# EAGLE design stm v0.1 (EAGLE 9.4.1)
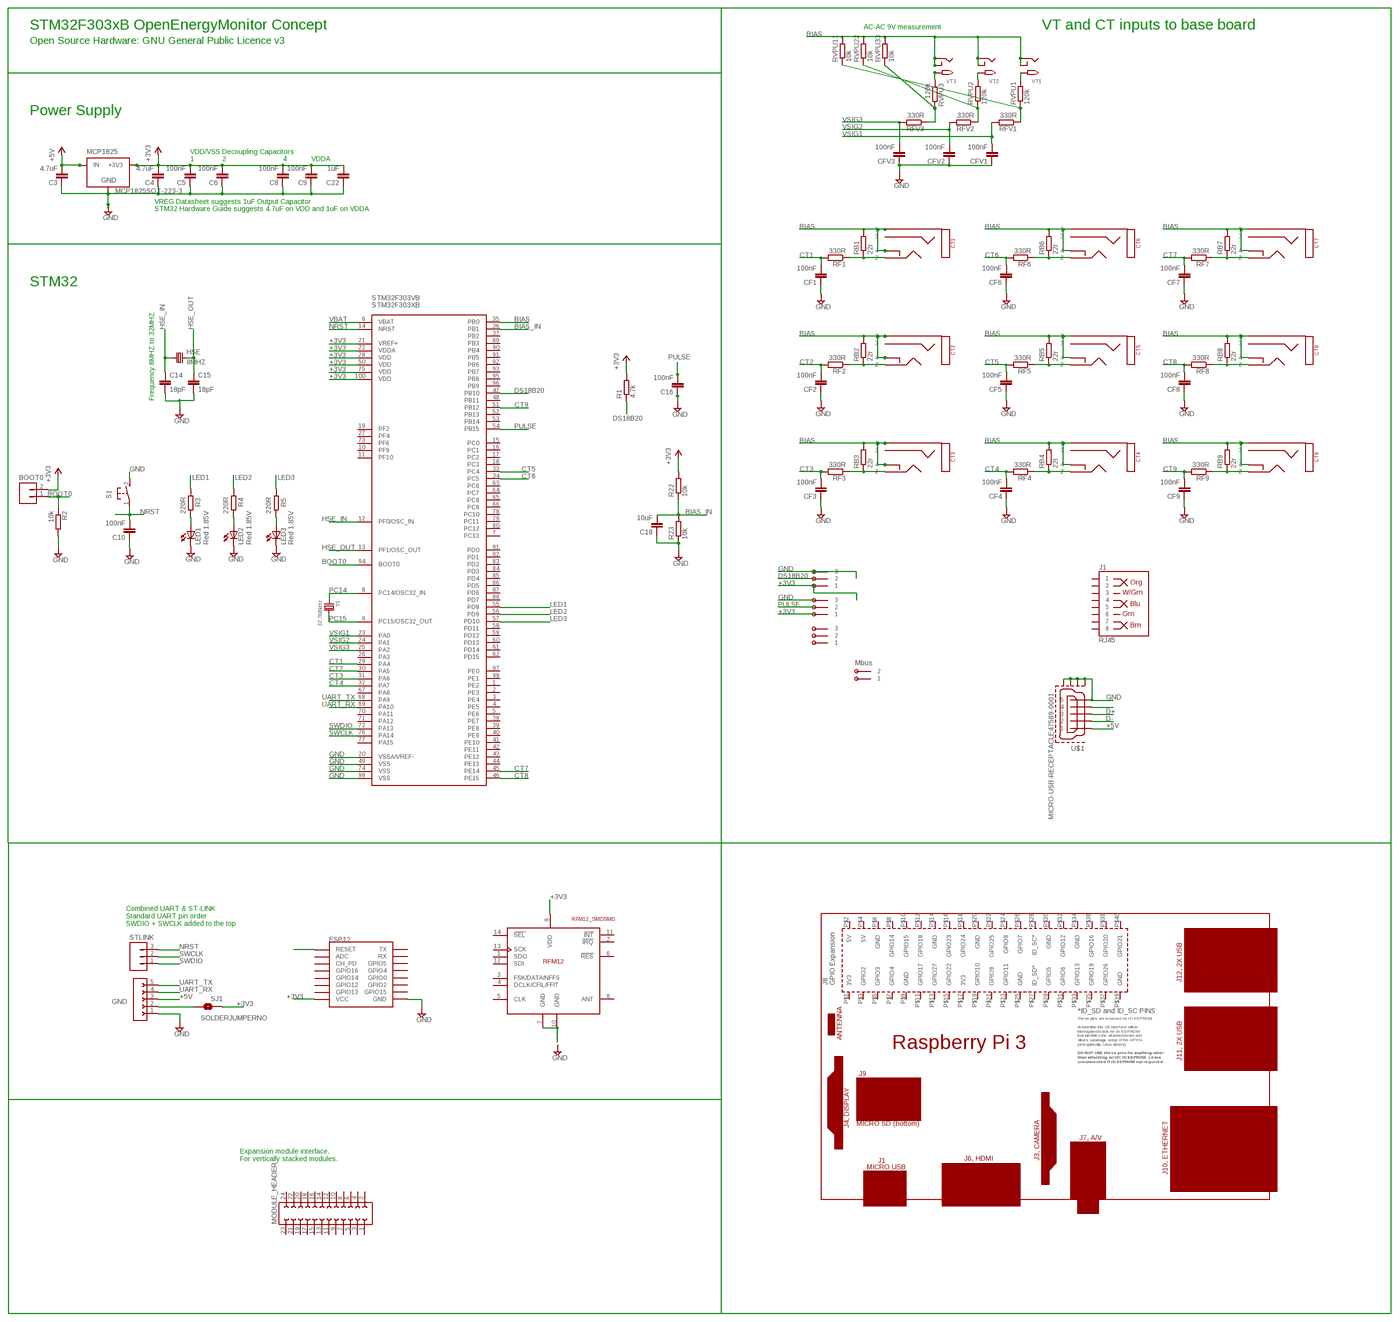
[diagram p0: schematic, sheet 1, overview]
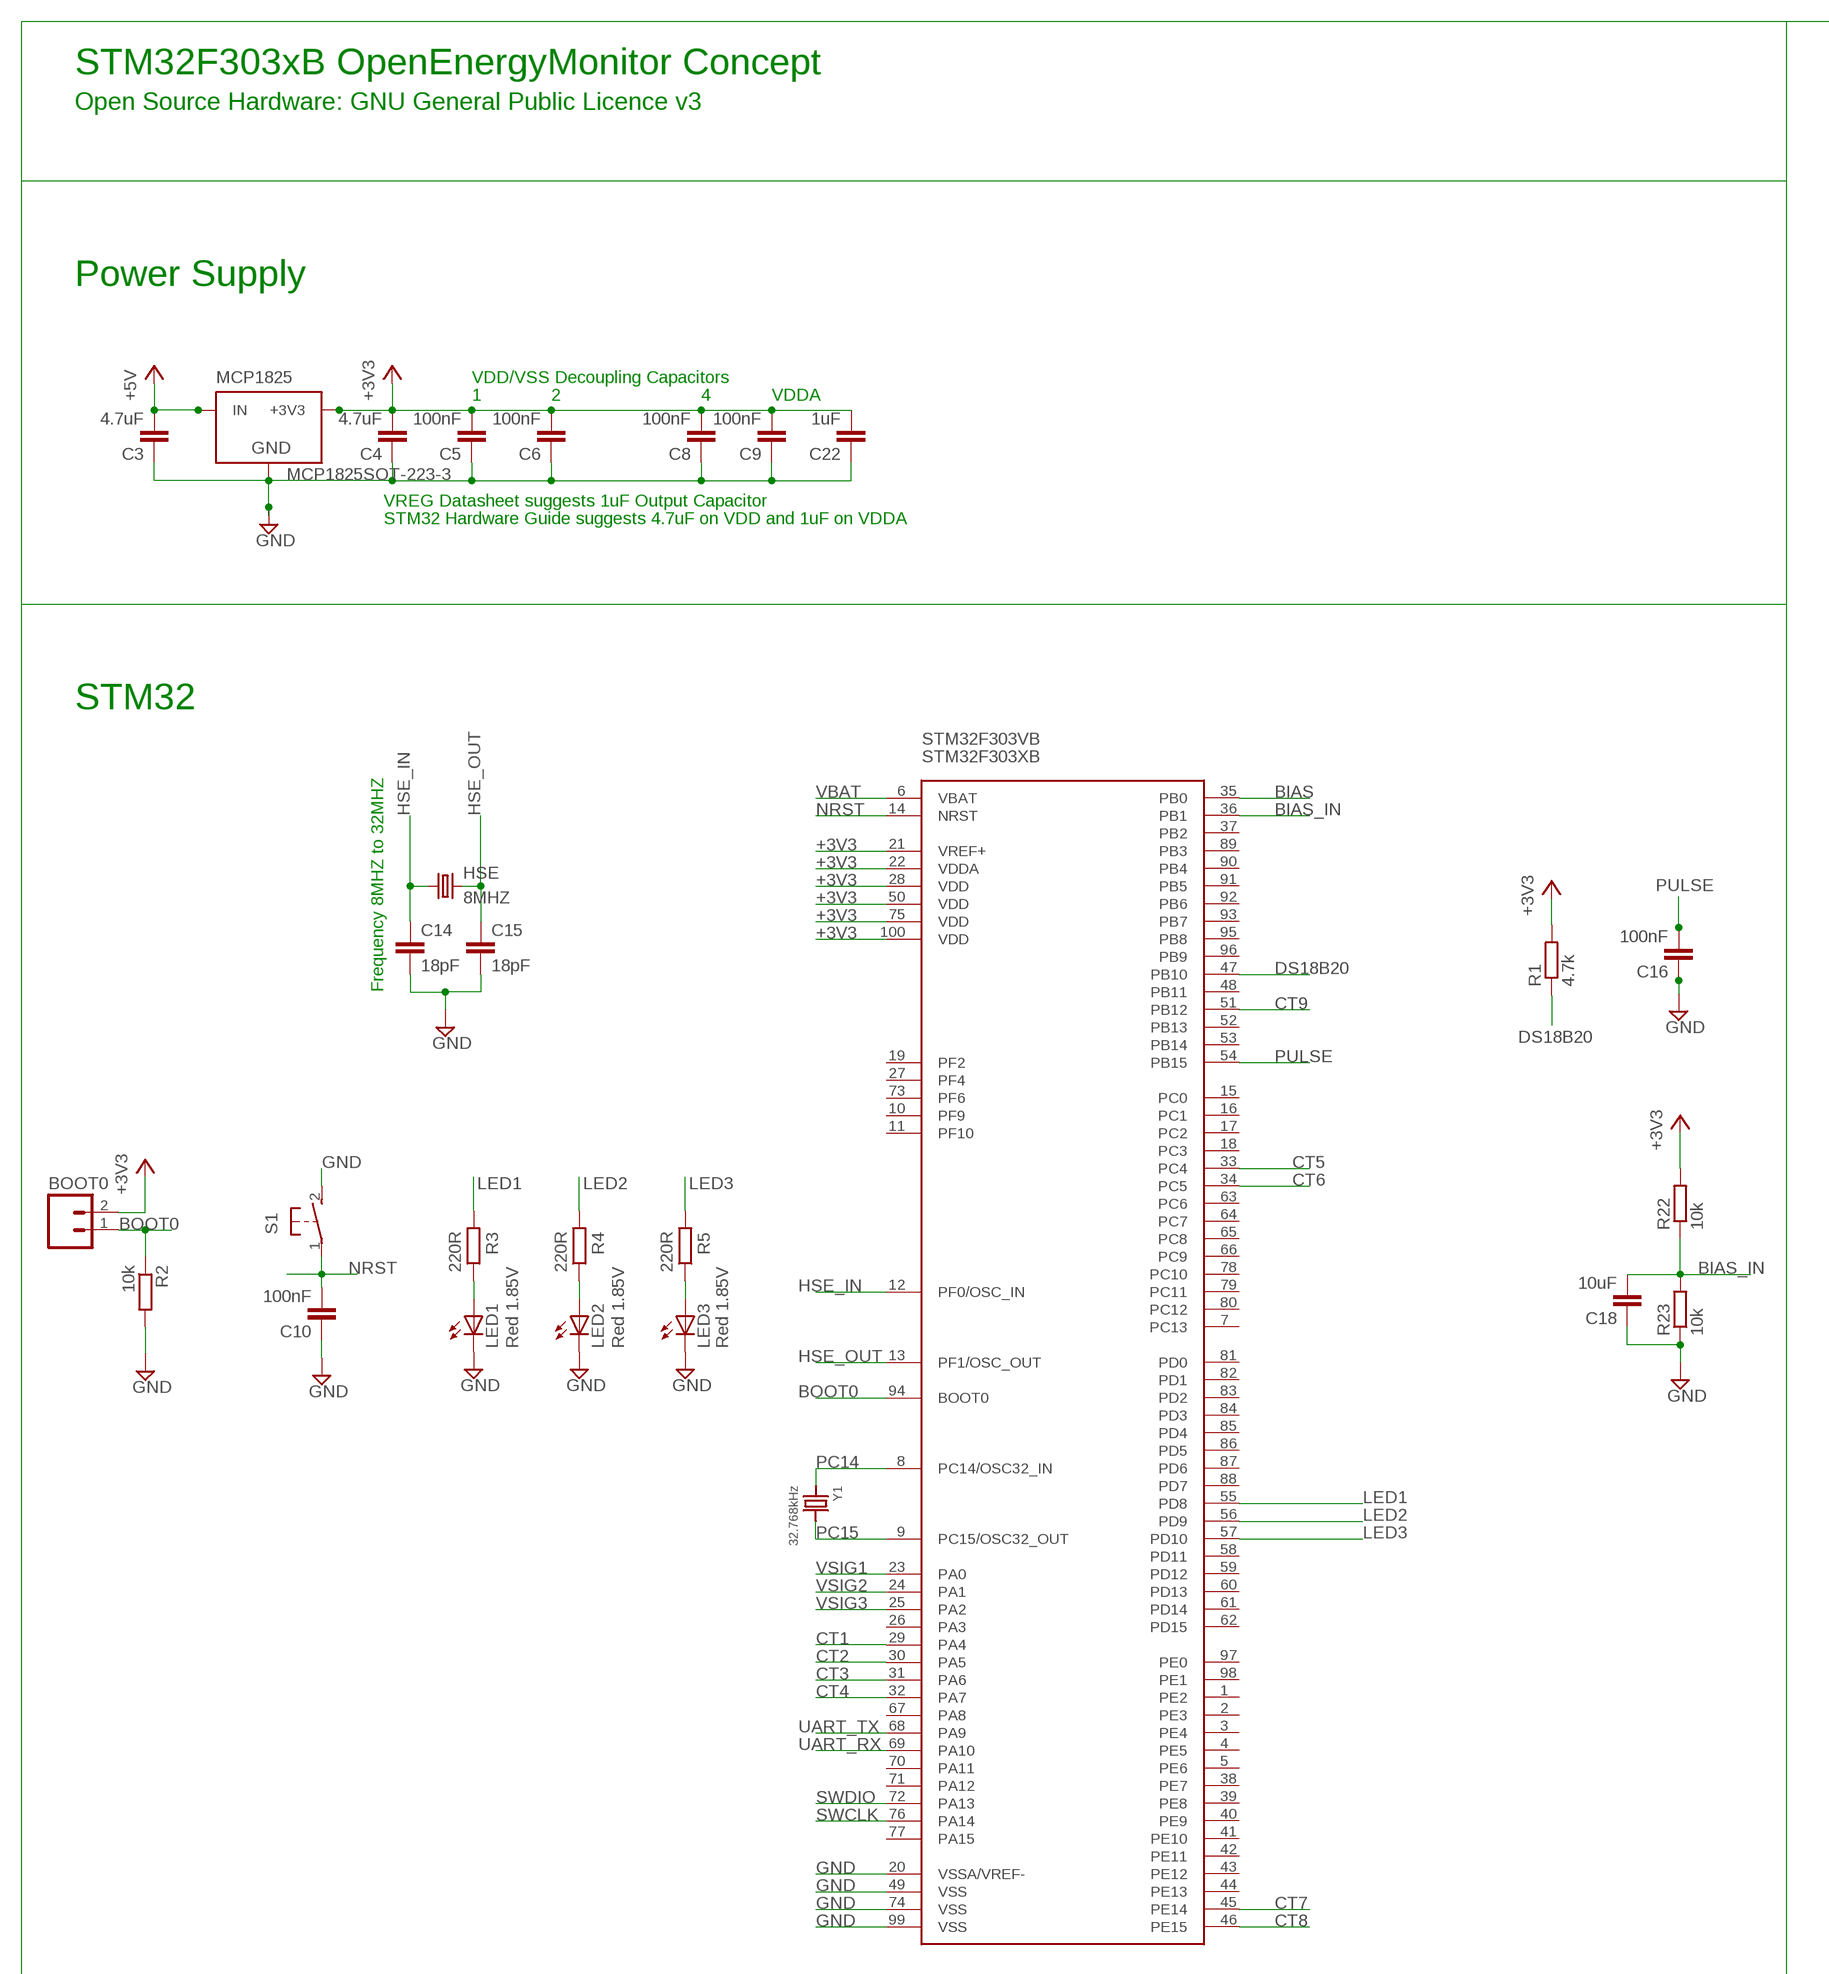
[diagram p1: schematic, sheet 1, part 1 of 4]
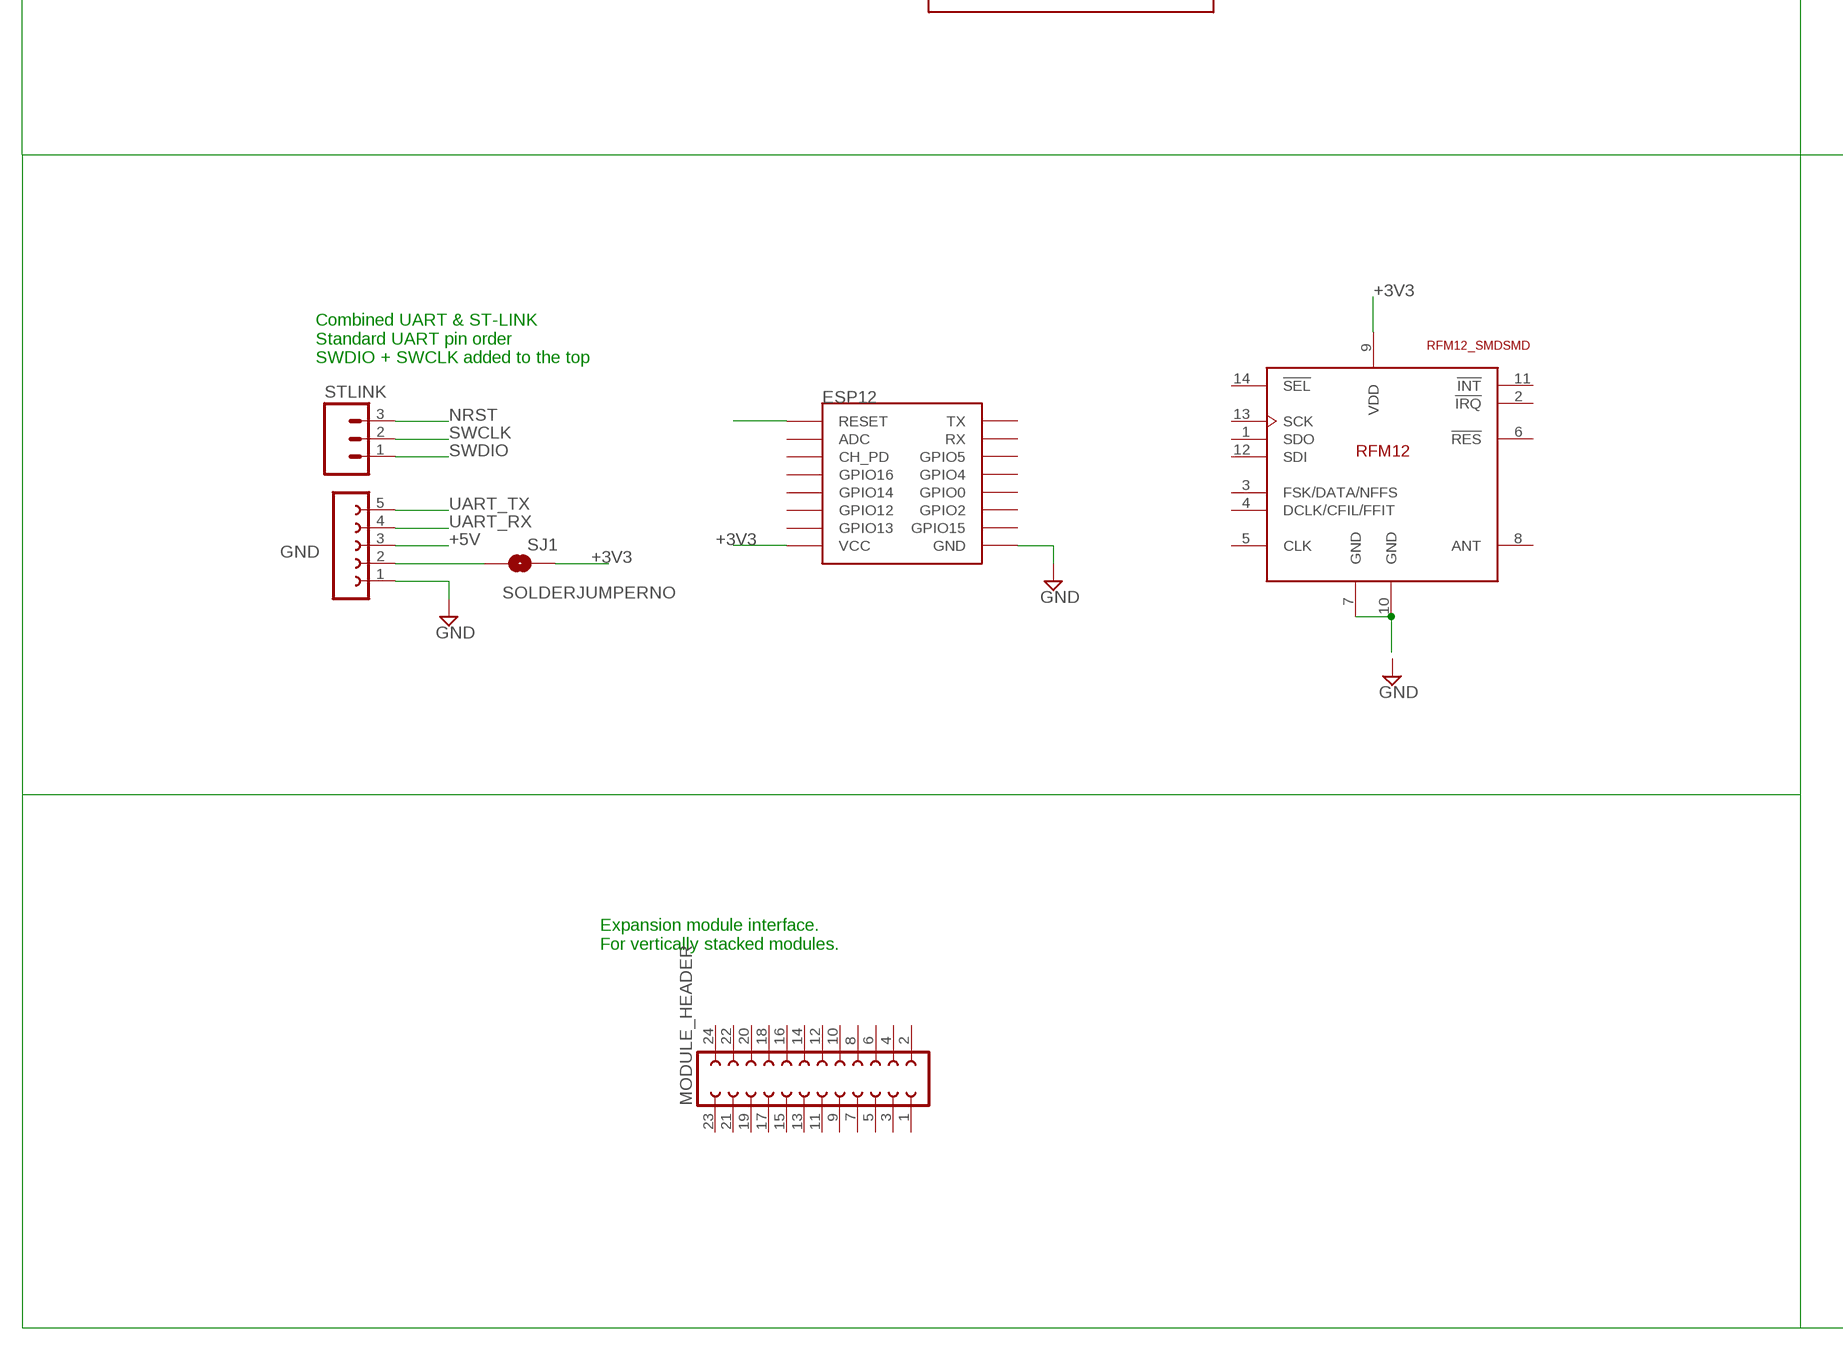
[diagram p2: schematic, sheet 1, part 2 of 4]
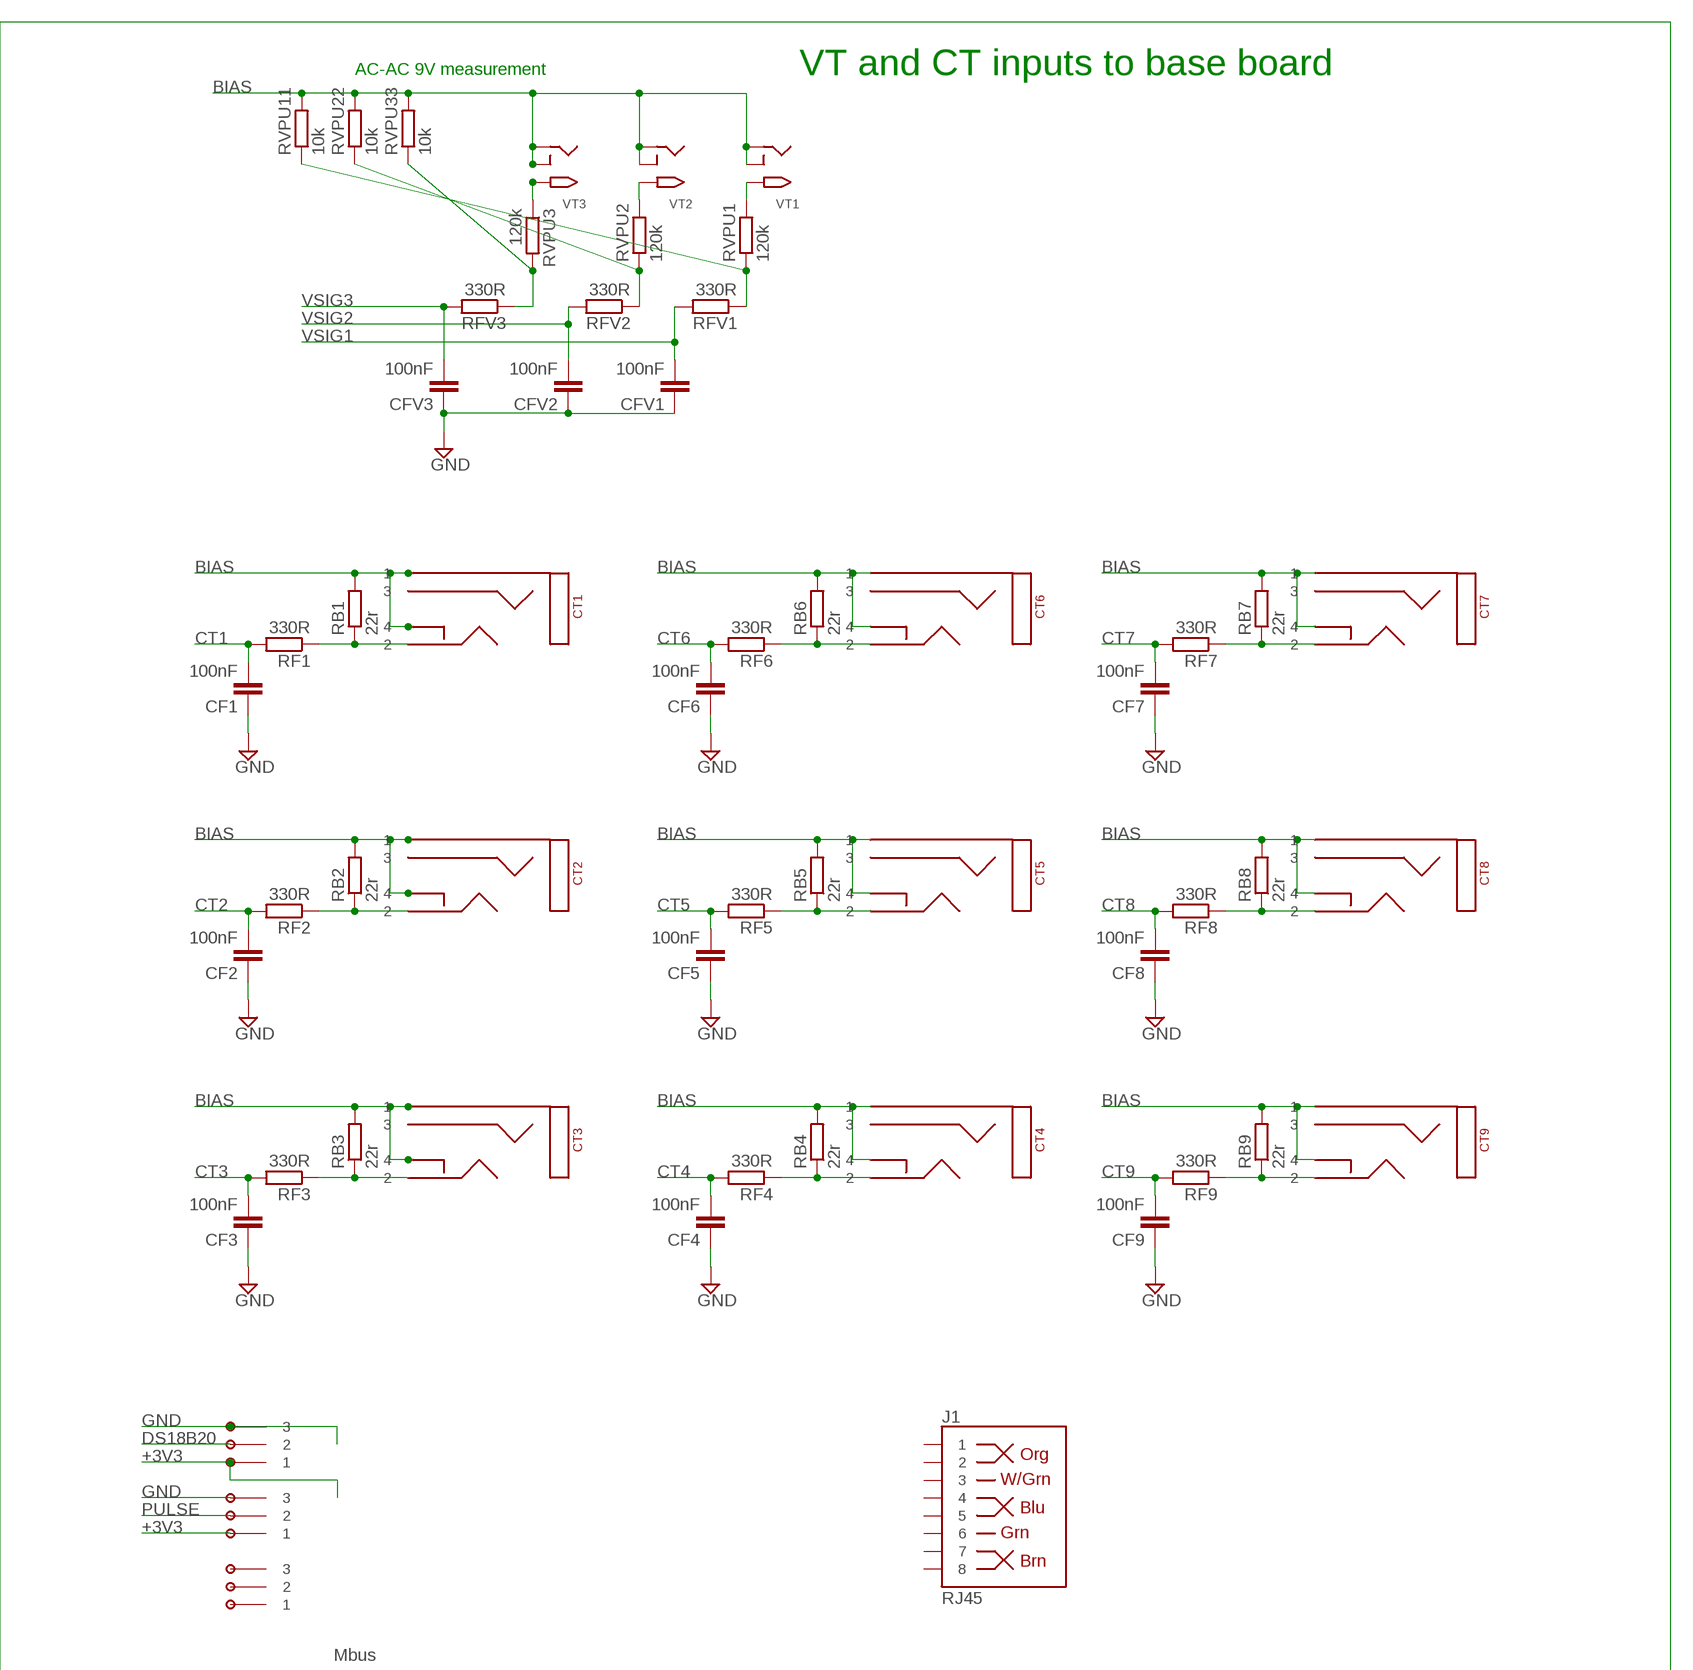
[diagram p3: schematic, sheet 1, part 3 of 4]
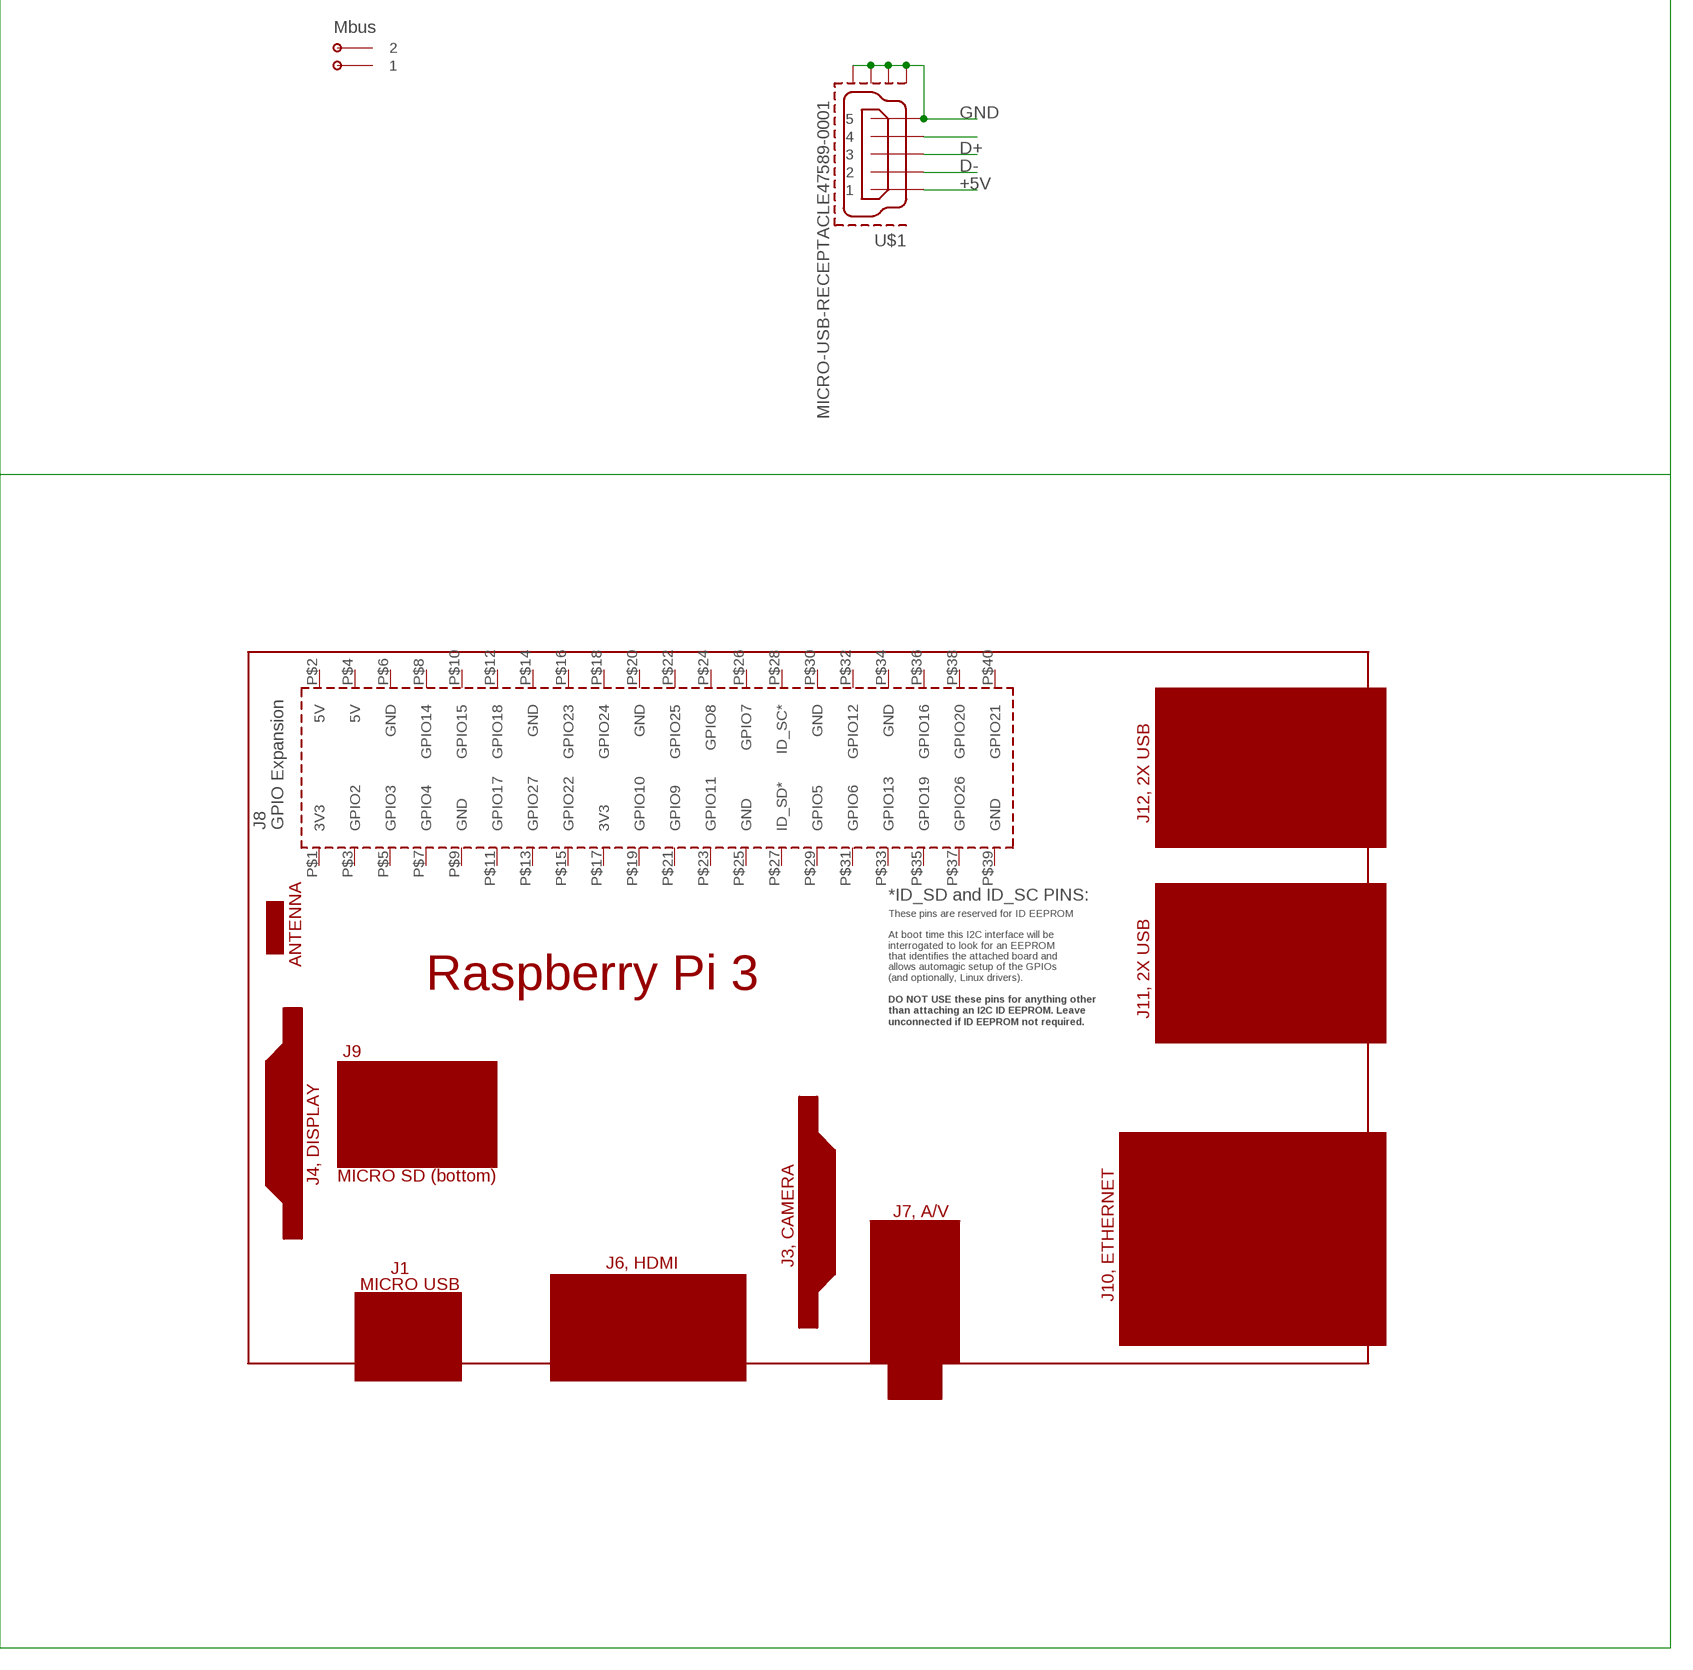
[diagram p4: schematic, sheet 1, part 4 of 4]

## Parts
BOOT0  M02PTH  [1X02]
C3  4.7uF  C-EUC1210  [C1210]
C4  4.7uF  C-EUC1210  [C1210]
C5  100nF  C-EUC0603  [C0603]
C6  100nF  C-EUC0603  [C0603]
C8  100nF  C-EUC0603  [C0603]
C9  100nF  C-EUC0603  [C0603]
C10  100nF  C-EUC0603  [C0603]
C14  18pF  C-EUC0603  [C0603]
C15  18pF  C-EUC0603  [C0603]
C16  100nF  C-EUC0603  [C0603]
C18  10uF  C-EUC0603  [C0603]
C22  1uF  C-EUC1210  [C1210]
CF1  100nF  C-EUC0603  [C0603]
CF2  100nF  C-EUC0603  [C0603]
CF3  100nF  C-EUC0603  [C0603]
CF4  100nF  C-EUC0603  [C0603]
CF5  100nF  C-EUC0603  [C0603]
CF6  100nF  C-EUC0603  [C0603]
CF7  100nF  C-EUC0603  [C0603]
CF8  100nF  C-EUC0603  [C0603]
CF9  100nF  C-EUC0603  [C0603]
CFV1  100nF  C-EUC0603  [C0603]
CFV2  100nF  C-EUC0603  [C0603]
CFV3  100nF  C-EUC0603  [C0603]
CT1  STEREO_SMD  [STEREO_SMT]
CT2  STEREO_SMD  [STEREO_SMT]
CT3  STEREO_SMD  [STEREO_SMT]
CT4  STEREO_SMD  [STEREO_SMT]
CT5  STEREO_SMD  [STEREO_SMT]
CT6  STEREO_SMD  [STEREO_SMT]
CT7  STEREO_SMD  [STEREO_SMT]
CT8  STEREO_SMD  [STEREO_SMT]
CT9  STEREO_SMD  [STEREO_SMT]
ESP12  ESP12SMD  [ESP12-SMD]
GND  UART  FE05-1  [FE05-1]
HSE  8MHZ  CRYSTALCTS406  [CTS406]
J1  RJ45  RJ45-8  [RJ45-8]
LED1  Red 1.85V  LEDCHIP-LED0805  [CHIP-LED0805]
LED2  Red 1.85V  LEDCHIP-LED0805  [CHIP-LED0805]
LED3  Red 1.85V  LEDCHIP-LED0805  [CHIP-LED0805]
MCP1825  MCP1825SOT-223-3  [SOT-223]
MODULE_HEADER  FE12-2  [FE12-2]
PCB1  RPI3RPI3  [RPI3]
R1  4.7k  R-EU_R0603  [R0603]
R2  10k  R-EU_R0603  [R0603]
R3  220R  R-EU_R0603  [R0603]
R4  220R  R-EU_R0603  [R0603]
R5  220R  R-EU_R0603  [R0603]
R22  10k  R-EU_R0603  [R0603]
R23  10k  R-EU_R0603  [R0603]
RB1  22r  R-EU_R0603  [R0603]
RB2  22r  R-EU_R0603  [R0603]
RB3  22r  R-EU_R0603  [R0603]
RB4  22r  R-EU_R0603  [R0603]
RB5  22r  R-EU_R0603  [R0603]
RB6  22r  R-EU_R0603  [R0603]
RB7  22r  R-EU_R0603  [R0603]
RB8  22r  R-EU_R0603  [R0603]
RB9  22r  R-EU_R0603  [R0603]
RF1  330R  R-EU_R0603  [R0603]
RF2  330R  R-EU_R0603  [R0603]
RF3  330R  R-EU_R0603  [R0603]
RF4  330R  R-EU_R0603  [R0603]
RF5  330R  R-EU_R0603  [R0603]
RF6  330R  R-EU_R0603  [R0603]
RF7  330R  R-EU_R0603  [R0603]
RF8  330R  R-EU_R0603  [R0603]
RF9  330R  R-EU_R0603  [R0603]
RFM69HCW  RFM12_SMDSMD  [RFM12]
RFV1  330R  R-EU_R0603  [R0603]
RFV2  330R  R-EU_R0603  [R0603]
RFV3  330R  R-EU_R0603  [R0603]
RVPU1  120k  R-EU_R0603  [R0603]
RVPU2  120k  R-EU_R0603  [R0603]
RVPU3  120k  R-EU_R0603  [R0603]
RVPU11  10k  R-EU_R0603  [R0603]
RVPU22  10k  R-EU_R0603  [R0603]
RVPU33  10k  R-EU_R0603  [R0603]
S1  31-XX  [B3F-31XX]
SJ1  SOLDERJUMPERNO  [SJ_2S-NO]
STLINK  M03PTH  [1X03]
STM32F303VB  STM32F303XB  [TQFP100]
U$1  MICRO-USB-RECEPTACLE47589-0001  [47589-0001]
U$4  OMNIMATE_LSF_3  [OMNIMATE_LSF_3]
U$5  OMNIMATE_LSF_3  [OMNIMATE_LSF_3]
U$6  OMNIMATE_LSF_3  [OMNIMATE_LSF_3]
U$11  OMNIMATE_LSF_2  [OMNIMATE_LSF_2]
VT1  2.1MMJACKSMT  [DCJACK_2MM_SMT]
VT2  2.1MMJACKSMT  [DCJACK_2MM_SMT]
VT3  2.1MMJACKSMT  [DCJACK_2MM_SMT]
Y1  32.768kHz  CRYSTAL8X3.8SMT  [CRYSTAL_8X3.8]

## Nets
+3V3: BOOT0.2 C4.2 C5.2 C6.2 C8.2 C9.2 C22.2 ESP12.VCC MCP1825.3(+3V3) R1.2 R22.2 RFM69HCW.9(VDD) SJ1.2 STM32F303VB.21(VREF+) STM32F303VB.22(VDDA) STM32F303VB.28(VDD) STM32F303VB.50(VDD) STM32F303VB.75(VDD) STM32F303VB.100(VDD) U$4.P$1 U$4.P$2 U$5.P$1 U$5.P$2
+5V [power]: C3.2 GND.3 MCP1825.1(IN) U$1.1
AC1: RVPU1.2 VT1.PWR2(TIP)
AC2: RVPU2.2 VT2.PWR2(TIP)
AC3: RVPU3.1 VT3.PWR2(TIP)
ADC0: RFV3.1 RVPU3.2 RVPU33.1
BIAS: CT1.P$1 CT1.P$4 CT2.P$1 CT2.P$4 CT3.P$1 CT3.P$4 CT4.P$1 CT4.P$4 CT5.P$1 CT5.P$4 CT6.P$1 CT6.P$4 CT7.P$1 CT7.P$4 CT8.P$1 CT8.P$4 CT9.P$1 CT9.P$4 RB1.2 RB2.2 RB3.2 RB4.2 RB5.2 RB6.2 RB7.2 RB8.2 RB9.2 RVPU11.2 RVPU22.2 RVPU33.2 STM32F303VB.35(PB0) VT1.GND(RING) VT1.GNDBREAK(RING_SW) VT2.GND(RING) VT2.GNDBREAK(RING_SW) VT3.GND(RING) VT3.GNDBREAK(RING_SW)
BIAS_IN: C18.2 R22.1 R23.2 STM32F303VB.36(PB1)
BOOT0: BOOT0.1 R2.1 STM32F303VB.94(BOOT0)
CT1: CF1.2 RF1.2 STM32F303VB.29(PA4)
CT2: CF2.2 RF2.2 STM32F303VB.30(PA5)
CT3: CF3.2 RF3.2 STM32F303VB.31(PA6)
CT4: CF4.2 RF4.2 STM32F303VB.32(PA7)
CT5: CF5.2 RF5.2 STM32F303VB.33(PC4)
CT6: CF6.2 RF6.2 STM32F303VB.34(PC5)
CT7: CF7.2 RF7.2 STM32F303VB.45(PE14)
CT8: CF8.2 RF8.2 STM32F303VB.46(PE15)
CT9: CF9.2 RF9.2 STM32F303VB.51(PB12)
D+: U$1.3
D-: U$1.2
DS18B20: R1.1 STM32F303VB.47(PB10) U$4.P$3 U$4.P$4
GND: C3.1 C4.1 C5.1 C6.1 C8.1 C9.1 C10.1 C14.2 C15.2 C16.1 C18.1 C22.1 CF1.1 CF2.1 CF3.1 CF4.1 CF5.1 CF6.1 CF7.1 CF8.1 CF9.1 CFV1.1 CFV2.1 CFV3.1 ESP12.GND GND.1 LED1.C LED2.C LED3.C MCP1825.2(GND) R2.2 R23.1 S1.2(S) STM32F303VB.20(VSSA/VREF-) STM32F303VB.49(VSS) STM32F303VB.74(VSS) STM32F303VB.99(VSS) U$1.5 U$1.CASING1(GND1) U$1.CASING2(GND2) U$1.CASING3(GND3) U$1.CASING4(GND4) U$4.P$5 U$4.P$6 U$5.P$5 U$5.P$6
HSE_IN: C14.1 HSE.1 STM32F303VB.12(PF0/OSC_IN)
HSE_OUT: C15.1 HSE.3 STM32F303VB.13(PF1/OSC_OUT)
LED1: R3.2 STM32F303VB.55(PD8)
LED2: R4.2 STM32F303VB.56(PD9)
LED3: R5.2 STM32F303VB.57(PD10)
N$1: GND.2 SJ1.1
N$2: CT1.P$2 RB1.1 RF1.1
N$5: LED2.A R4.1
N$6: LED3.A R5.1
N$7: ESP12.RESET
N$8: CT2.P$2 RB2.1 RF2.1
N$9: RFM69HCW.7(GND) RFM69HCW.10(GND)
N$10: CT3.P$2 RB3.1 RF3.1
N$12: U$1.4
N$34: RFV2.1 RVPU2.1 RVPU22.1
N$37: RFV1.1 RVPU1.1 RVPU11.1
N$38: CT4.P$2 RB4.1 RF4.1
N$39: CT5.P$2 RB5.1 RF5.1
N$40: CT6.P$2 RB6.1 RF6.1
N$41: LED1.A R3.1
N$42: CT7.P$2 RB7.1 RF7.1
N$43: CT8.P$2 RB8.1 RF8.1
N$44: CT9.P$2 RB9.1 RF9.1
NRST: C10.2 S1.1(P) STLINK.3 STM32F303VB.14(NRST)
PC14: STM32F303VB.8(PC14/OSC32_IN) Y1.P$1
PC15: STM32F303VB.9(PC15/OSC32_OUT) Y1.P$4
PULSE: C16.2 STM32F303VB.54(PB15) U$5.P$3 U$5.P$4
SWCLK: STLINK.2 STM32F303VB.76(PA14)
SWDIO: STLINK.1 STM32F303VB.72(PA13)
UART_RX: GND.4 STM32F303VB.69(PA10)
UART_TX: GND.5 STM32F303VB.68(PA9)
VBAT: STM32F303VB.6(VBAT)
VSIG1: CFV1.2 RFV1.2 STM32F303VB.23(PA0)
VSIG2: CFV2.2 RFV2.2 STM32F303VB.24(PA1)
VSIG3: CFV3.2 RFV3.2 STM32F303VB.25(PA2)
Unconnected: CT1.P$3 CT2.P$3 CT3.P$3 CT4.P$3 CT5.P$3 CT6.P$3 CT7.P$3 CT8.P$3 CT9.P$3 ESP12.ADC ESP12.CH_PD ESP12.GPIO0 ESP12.GPIO2 ESP12.GPIO4 ESP12.GPIO5 ESP12.GPIO12 ESP12.GPIO13 ESP12.GPIO14 ESP12.GPIO15 ESP12.GPIO16 ESP12.RXD0(RX) ESP12.TXD0(TX) J1.1 J1.2 J1.3 J1.4 J1.5 J1.6 J1.7 J1.8 MODULE_HEADER.1 MODULE_HEADER.2 MODULE_HEADER.3 MODULE_HEADER.4 MODULE_HEADER.5 MODULE_HEADER.6 MODULE_HEADER.7 MODULE_HEADER.8 MODULE_HEADER.9 MODULE_HEADER.10 MODULE_HEADER.11 MODULE_HEADER.12 MODULE_HEADER.13 MODULE_HEADER.14 MODULE_HEADER.15 MODULE_HEADER.16 MODULE_HEADER.17 MODULE_HEADER.18 MODULE_HEADER.19 MODULE_HEADER.20 MODULE_HEADER.21 MODULE_HEADER.22 MODULE_HEADER.23 MODULE_HEADER.24 PCB1.P$1(3V3) PCB1.P$2(5V) PCB1.P$3(GPIO2) PCB1.P$4(5V) PCB1.P$5(GPIO3) PCB1.P$6(GND) PCB1.P$7(GPIO4) PCB1.P$8(GPIO14) PCB1.P$9(GND) PCB1.P$10(GPIO15) PCB1.P$11(GPIO17) PCB1.P$12(GPIO18) PCB1.P$13(GPIO27) PCB1.P$14(GND) PCB1.P$15(GPIO22) PCB1.P$16(GPIO23) PCB1.P$17(3V3) PCB1.P$18(GPIO24) PCB1.P$19(GPIO10) PCB1.P$20(GND) PCB1.P$21(GPIO9) PCB1.P$22(GPIO25) PCB1.P$23(GPIO11) PCB1.P$24(GPIO8) PCB1.P$25(GND) PCB1.P$26(GPIO7) PCB1.P$27(ID_SD*) PCB1.P$28(ID_SC*) PCB1.P$29(GPIO5) PCB1.P$30(GND) PCB1.P$31(GPIO6) PCB1.P$32(GPIO12) PCB1.P$33(GPIO13) PCB1.P$34(GND) PCB1.P$35(GPIO19) PCB1.P$36(GPIO16) PCB1.P$37(GPIO26) PCB1.P$38(GPIO20) PCB1.P$39(GND) PCB1.P$40(GPIO21) RFM69HCW.1(SDO) RFM69HCW.2(!IRQ) RFM69HCW.3(FSK/DATA/NFFS) RFM69HCW.4(DCLK/CFIL/FFIT) RFM69HCW.5(CLK) RFM69HCW.6(!RES) RFM69HCW.8(ANT) RFM69HCW.11(!INT) RFM69HCW.12(SDI) RFM69HCW.13(SCK) RFM69HCW.14(!SEL) STM32F303VB.1(PE2) STM32F303VB.2(PE3) STM32F303VB.3(PE4) STM32F303VB.4(PE5) STM32F303VB.5(PE6) STM32F303VB.7(PC13) STM32F303VB.10(PF9) STM32F303VB.11(PF10) STM32F303VB.15(PC0) STM32F303VB.16(PC1) STM32F303VB.17(PC2) STM32F303VB.18(PC3) STM32F303VB.19(PF2) STM32F303VB.26(PA3) STM32F303VB.27(PF4) STM32F303VB.37(PB2) STM32F303VB.38(PE7) STM32F303VB.39(PE8) STM32F303VB.40(PE9) STM32F303VB.41(PE10) STM32F303VB.42(PE11) STM32F303VB.43(PE12) STM32F303VB.44(PE13) STM32F303VB.48(PB11) STM32F303VB.52(PB13) STM32F303VB.53(PB14) STM32F303VB.58(PD11) STM32F303VB.59(PD12) STM32F303VB.60(PD13) STM32F303VB.61(PD14) STM32F303VB.62(PD15) STM32F303VB.63(PC6) STM32F303VB.64(PC7) STM32F303VB.65(PC8) STM32F303VB.66(PC9) STM32F303VB.67(PA8) STM32F303VB.70(PA11) STM32F303VB.71(PA12) STM32F303VB.73(PF6) STM32F303VB.77(PA15) STM32F303VB.78(PC10) STM32F303VB.79(PC11) STM32F303VB.80(PC12) STM32F303VB.81(PD0) STM32F303VB.82(PD1) STM32F303VB.83(PD2) STM32F303VB.84(PD3) STM32F303VB.85(PD4) STM32F303VB.86(PD5) STM32F303VB.87(PD6) STM32F303VB.88(PD7) STM32F303VB.89(PB3) STM32F303VB.90(PB4) STM32F303VB.91(PB5) STM32F303VB.92(PB6) STM32F303VB.93(PB7) STM32F303VB.95(PB8) STM32F303VB.96(PB9) STM32F303VB.97(PE0) STM32F303VB.98(PE1) U$6.P$1 U$6.P$2 U$6.P$3 U$6.P$4 U$6.P$5 U$6.P$6 U$11.P$1 U$11.P$2 U$11.P$3 U$11.P$4

## Notes on the sheet
- STM32F303xB OpenEnergyMonitor Concept | AC-AC 9V measurement | VT and CT inputs to base board
- Open Source Hardware: GNU General Public Licence v3
- Power Supply
- VDD/VSS Decoupling Capacitors
- 1 | 2 | 4 | VDDA
- VREG Datasheet suggests 1uF Output Capacitor
- STM32 Hardware Guide suggests 4.7uF on VDD and 1uF on VDDA
- STM32
- Frequency 8MHZ to 32MHZ
- Mbus
- Combined UART & ST-LINK
  Standard UART pin order
  SWDIO + SWCLK added to the top
- Expansion module interface.
  For vertically stacked modules.

## Library data of the parts
BOOT0 = SparkFun:M02: Header 2 Standard 2-pin 0.1" header. Use with straight break away headers (SKU : PRT-00116), right angle break away headers (PRT-00553), swiss pins (PRT-00743), machine pins (PRT-00117), and female headers (PRT-00115). Molex polarized connector foot print use with SKU : PRT-08233 with associated crimp pins and housings.
C3 C4 C22 = rcl:C-EU: CAPACITOR, European symbol; SPICEPREFIX: C
C5 C6 C8-C10 C14-C16 C18 CF1-CF9 CFV1-CFV3 = resistor:C-EU: CAPACITOR, European symbol
CT1-CT9 = IotaWatt_parts:STEREO_SMD: 3.5mm Stereo Jack SMT
ESP12 = ESP8266 MODULES _ CORRECTED:ESP12: ESP8266 Wifi module 12
GND = con-lsta:FE05-1: FEMALE HEADER; OC_FARNELL: unknown; OC_NEWARK: unknown
HSE = crystal:CRYSTAL: CRYSTAL; OC_FARNELL: unknown; OC_NEWARK: unknown
J1 = SparkFun-Connectors:RJ45-8: RJ45 Jack - 8 pin Simple RJ45, 8-pin connection. Commonly used for Cat5, Cat5e, and Cat6 Ethernet cables. Here is the connector we sell at SparkFun: RJ45 8-Pin Connector <https://www.sparkfun.com/products/643> (PRT-00643) Datasheet <https://cdn.sparkfun.com/datasheets/Prototyping/04908.pdf> It is used on this SparkFun product: SparkFun RJ45 Breakout <https://www.sparkfun.com/products/716> (BOB-00716) Note, you may also be interested in the "MAGJACK" version of this. It is basically a RJ45 connector, but also has some status LEDs built into the connector housing. You can check that out in this library at the device named "MAGJACK.dev" and see these products online: RJ45 Ethernet MagJack-Compatible <https://www.sparkfun.com/products/8534> (PRT-08534) SparkFun RJ45 MagJack Breakout <https://www.sparkfun.com/products/13021> (BOB-13021); PROD_ID: CONN-08506; SF_ID: PRT-00643
LED1-LED3 = adafruit:LED: LED OSRAM: - CHIPLED LG R971, LG N971, LY N971, LG Q971, LY Q971, LO R971, LY R971 LH N974, LH R974 LS Q976, LO Q976, LY Q976 LO Q996 - Hyper CHIPLED LW Q18S LB Q993, LB Q99A, LB R99A - SideLED LS A670, LO A670, LY A670, LG A670, LP A670 LB A673, LV A673, LT A673, LW A673 LH A674 LY A675 LS A676, LA A676, LO A676, LY A676, LW A676 LS A679, LY A679, LG A679 - Hyper Micro SIDELED® LS Y876, LA Y876, LO Y876, LY Y876 LT Y87S - SmartLED LW L88C, LW L88S LB L89C, LB L89S, LG L890 LS L89K, LO L89K, LY L89K LS L896, LA L896, LO L896, LY L896 - TOPLED LS T670, LO T670, LY T670, LG T670, LP T670 LSG T670, LSP T670, LSY T670, LOP T670, LYG T670 LG T671, LOG T671, LSG T671 LB T673, LV T673, LT T673, LW T673 LH T674 LS T676, LA T676, LO T676, LY T676, LB T676, LH T676, LSB T676, LW T676 LB T67C, LV T67C, LT T67C, LS T67K, LO T67K, LY T67K, LW E67C LS E67B, LA E67B, LO E67B, LY E67B, LB E67C, LV E67C, LT E67C LW T67C LS T679, LY T679, LG T679 LS T770, LO T770, LY T770, LG T770, LP T770 LB T773, LV T773, LT T773, LW T773 LH T774 LS E675, LA E675, LY E675, LS T675 LS T776, LA T776, LO T776, LY T776, LB T776 LHGB T686 LT T68C, LB T68C - Hyper Mini TOPLED® LB M676 - Mini TOPLED Santana® LG M470 LS M47K, LO M47K, LY M47K Source: http://www.osram.convergy.de/
MCP1825 = SteelCaveRobotics-Power:MCP1825: MCP1825 3.3v LDO Linear Regulator
MODULE_HEADER = con-lsta-RFM69Pi:FE12-2: FEMALE HEADER; OC_FARNELL: unknown; OC_NEWARK: unknown
PCB1 = e14_Rpi3_RevA+mirror-pcb copy:RPI3: Device for Raspberry Pi 3 board created by Dave Young for www.element14.com More information and support community is available at https://www.element14.com/community/community/raspberry-pi Device for Raspberry Pi 3 board updated by Gerald Schwarz for www.element14.com On RPI3 addet the layer milling and created a mirrored shield.
R1 R2 R22 R23 RB1-RB9 RF1-RF9 RFV1-RFV3 RVPU1-RVPU3 RVPU11 RVPU22 RVPU33 = resistor:R-EU_: RESISTOR, European symbol
R3-R5 = rcl:R-EU_: RESISTOR, European symbol; SPICEPREFIX: R
RFM69HCW = rfm12b _ rfm69cw:RFM12_SMD: RFM12 is a low costing ISM band transceiver module implemented with unique PLL. It works signal ranges from 315/433/868/915MHZ bands, comply with FCC, ETSI regulation. The SPI interface is used to communicate with microcontroller for parameter setting.
S1 = switch-omron:31-XX: OMRON SWITCH; MPN: B3F-3100; OC_FARNELL: 959704; OC_NEWARK: 36M3582
SJ1 = SparkFun:SOLDERJUMPER: Solder Jumper Standard SMD solder jumper. Used to automate production. Two varients : Normally Open and Normally Closed are the same, but have different paste layers. NC will have a large amount of paste and should jumper during reflow.
STLINK = SparkFun:M03: Header 3 Standard 3-pin 0.1" header. Use with straight break away headers (SKU : PRT-00116), right angle break away headers (PRT-00553), swiss pins (PRT-00743), machine pins (PRT-00117), and female headers (PRT-00115). Molex polarized connector foot print use with SKU : PRT-08232 with associated crimp pins and housings.
STM32F303VB = stm32f303:STM32F303XB
U$1 = con-molex-usb:MICRO-USB-RECEPTACLE: MICRO USB RECEPTACLES Micro-USB Receptacles, SMT, Lead-Free from MOLEX <http://www.molex.com/>. (C) 2014 Tomasz Boleslaw CEDRO, cederom@tlen.pl, http://www.tomek.cedro.info. Version 0.1 (2014-01-17): Initial release. Version 0.2 (2014-02-06): Updated 47589-0001 footprint pins/pads/milling. Following devices are included: 1. 47589-0001 Micro-USB AB Receptacle, Bottom Mount, SMT, Lead-Free <http://www.molex.com/molex/products/datasheet.jsp?part=active/0475890001_IO_CONNECTORS.xml> (Technical Drawing <http://www.molex.com/pdm_docs/sd/475890001_sd.pdf>).
U$4-U$6 = OMNIMATE_LSF:OMNIMATE_LSF_3
U$11 = OMNIMATE_LSF:OMNIMATE_LSF_2
VT1-VT3 = adafruit:2.1MMJACK: 2.1mm x 5.5mm THM DC jack with internal switch. Digikey part #PJ-102A, 4UCON part #05537 2.1mm x 5.5mm SMT DC jack with internal switch. Digikey part #PJ-002A-SMT, 4UCON part #03267 By microbuilder.eu & adafruit.com
Y1 = microbuilder:CRYSTAL: Crystals HC49UP - Surface Mount Crystal 4.0MHz 18pF +/-30ppm Surface Mount Crystal [Digikey: 535-9857-1-ND] 12.0 MHz Surface Mount Crystal [Digikey: 535-9869-6-ND] 25.0 MHz Surface Mount Crystal [Digikey: 535-9078-1-ND] 2.5 x 2.0mm - MEMs SMT Crystal 16.0 MHz 10pF 20ppm 2.5 x 2.0mm Crystal [Digikey -40-85°C: 535-10923-1-ND] 3.2 x 2.5mm - MEMs SMT Crystal 12.0 MHz 8pF 15ppm 3.2 x 2.5mm Crystal [Digikey: -10-70°C: 644-1047-1-ND -40-125°C: 644-1128-1-ND] 16.0 MHz 8pF 15ppm 3.2 x 2.5mm Crystal [Digikey: -10-70°C: 644-1049-1-ND -40-125°C: 644-1129-2-ND] 16.0 MHz 10pF 10ppm 3.2 x 2.5mm Crystal [Digikey: 644-1100-1-ND] 27.12 MHz 18pF 30ppm 3.2 x 2.5mm Crystal [Digikey: 887-1424-1-ND] 27.12MHz 10pF 10ppm 3.2 x 2.5mm Crystal [Digikey: 887-1329-1-ND] 4.9 x 1.8mm - MEMs SMT Crystal 32.768 KHz 12.5pF 20ppm 4.9 x 1.8mm Crystal [Digikey: SE2415CT-ND] 8.0 x 3.8mm - Surface Mount Crystal 32.768kHz 12.5pF 20ppm -40°C-85°C [Digikey: 535-9166-2-ND] Cylinder 32.768KHz Cylinder Crystal (2x6mm body) [Ex. Digikey: 300-8341-2-ND]

## Net classes
0 default: width 0.254 mm, drill 0.5 mm, clearance 0.152 mm
1 power: width 0.406 mm, drill 0.5 mm, clearance 0.254 mm
2 gnd: width 0.254 mm, drill 0.6 mm, clearance 0.254 mm

## Board
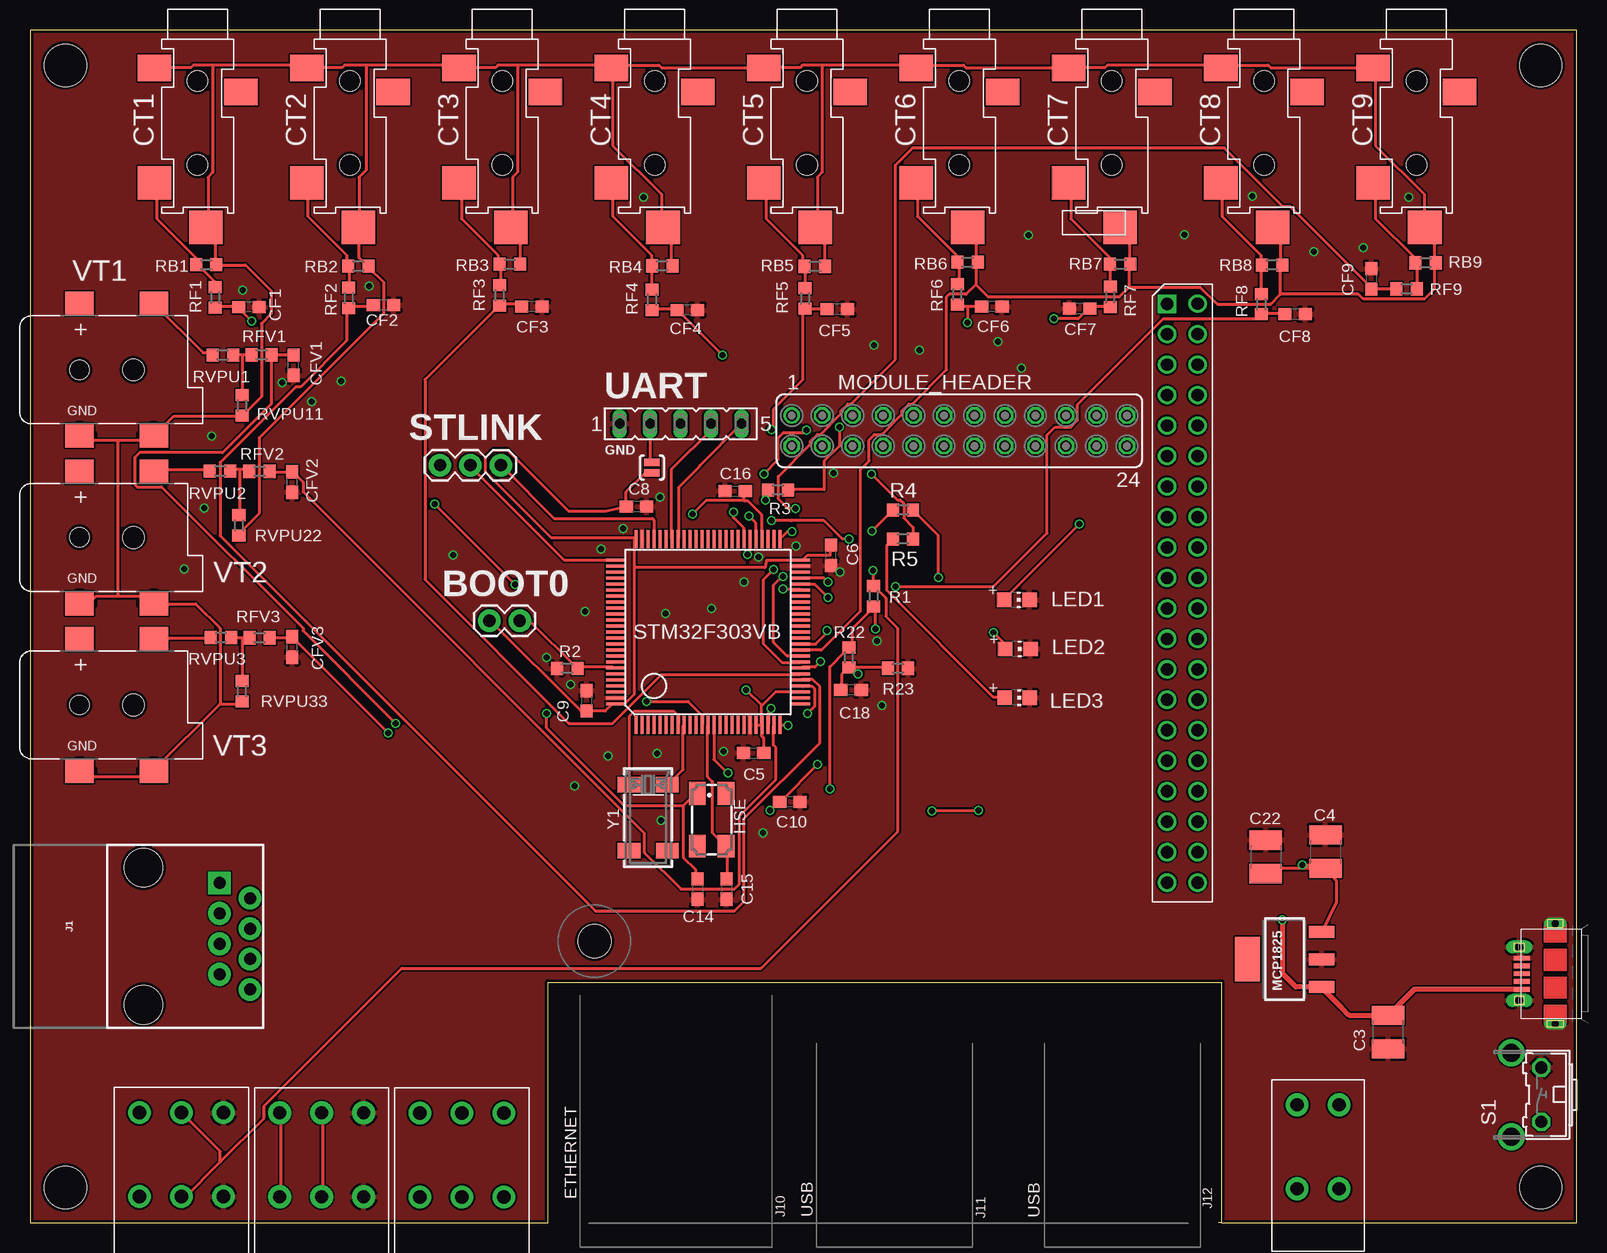
[diagram p5: board, top side]
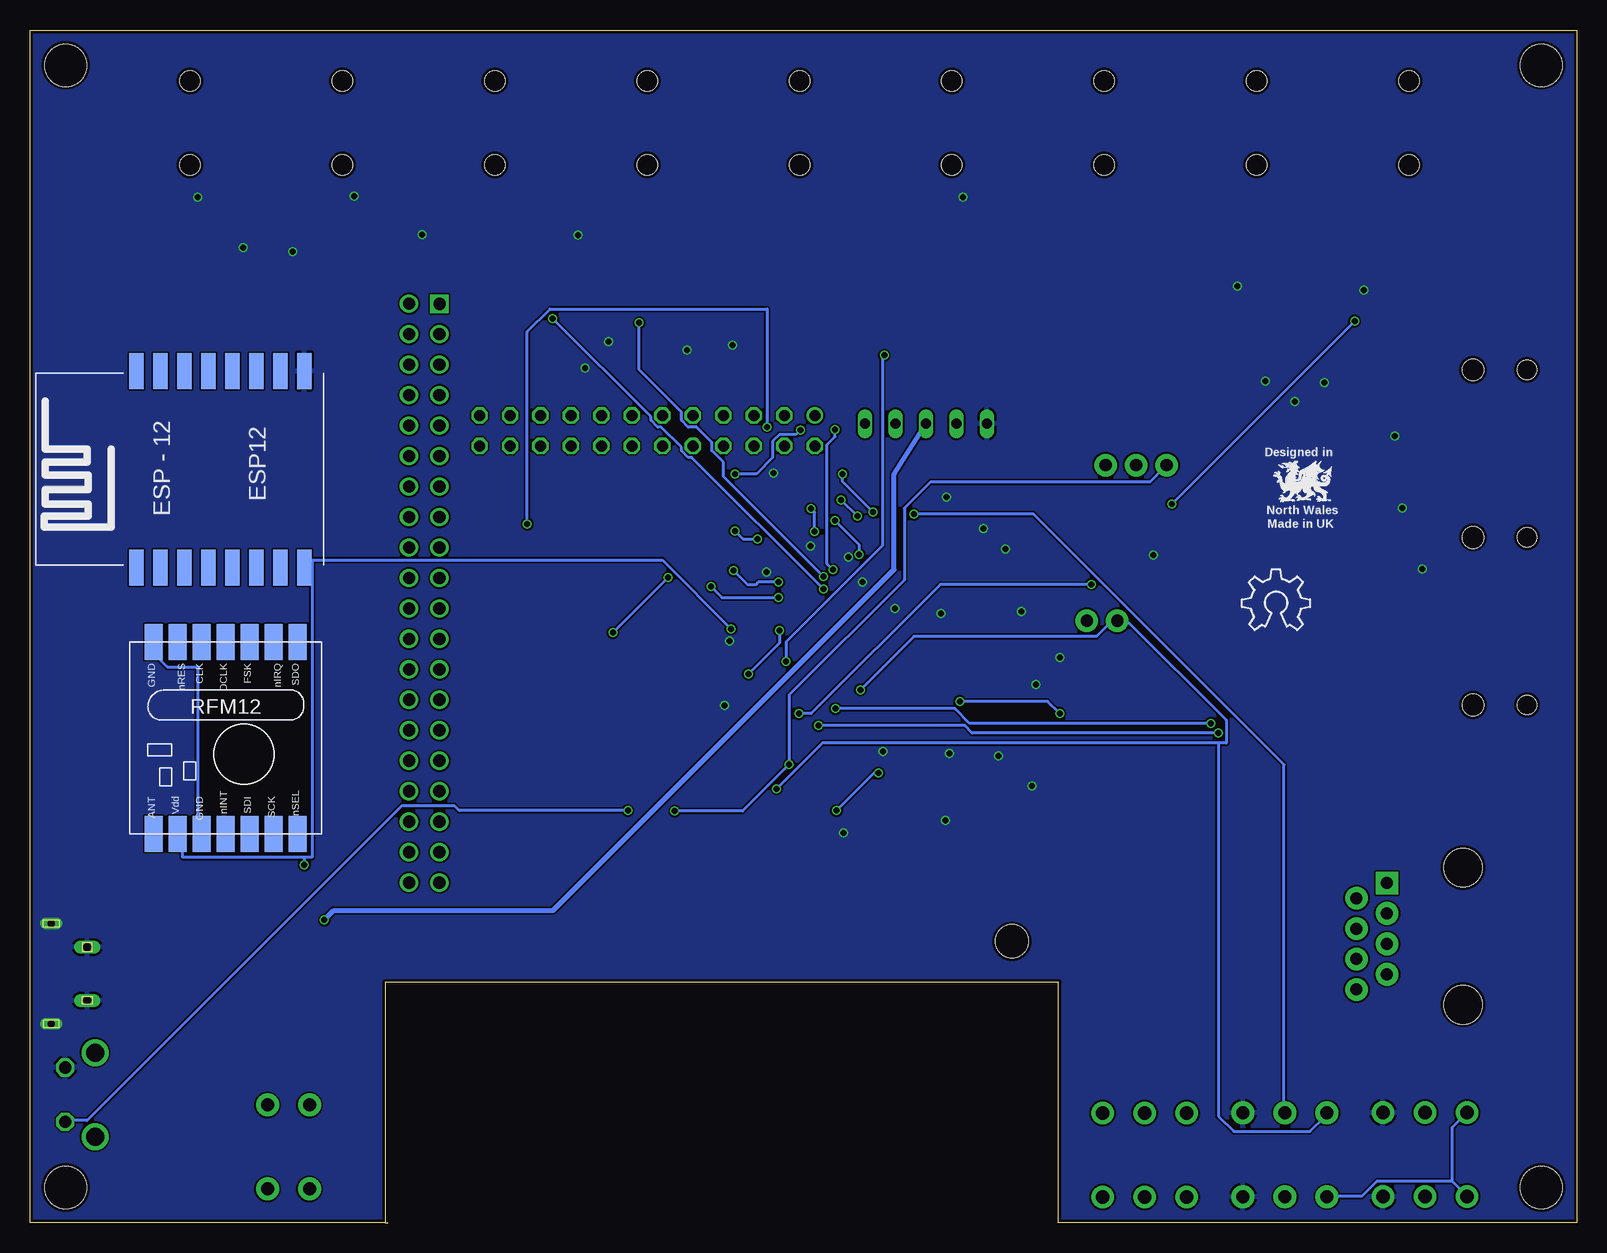
[diagram p6: board, bottom side, seen from below]

Size 128.92 x 99.45 mm. Coordinates in mm from the lower left corner, seen from the top.
Outline: 99.31,0 128.92,0 128.92,99.45 0,99.45 0,0 43.18,0 43.18,20.07 99.31,20.07 99.31,0
Outline: 99.31,0 99.06,0
Copper layers (1*16): Top 0.035mm / dielectric 1.53mm / Bottom 0.035mm
Design rules "jlcpcb *": minimum track width 6mil, minimum drill 0.45mm, track to track 6mil, track to pad 6mil, pad to pad 6mil, via to via 6mil, smd to smd 0mil, copper to edge 10mil, drill to drill 10mil, minimum pad ring 3mil, minimum via ring 3mil, stop-mask expansion 2mil, vias tented up to drill 25mil, thermal gap 8mil
Holes 3.5 mm at 125.95,96.5 2.95,96.5 2.95,2.95 125.95,2.95

### Footprints (pad centres in the part's own frame; a part is rotated, then mirrored left to right if it is on the bottom)
1X02 = drill 1.016 pad 1.88: 1 0,0; 2 2.54,0
C1210 = smd 1.6 x 2.7: 1 -1.4,0; 2 1.4,0
C0603 = smd 1.1 x 1: 1 -0.85,0; 2 0.85,0
STEREO_SMT = smd 2.8 x 2.2: P$1 -3.6,-2.4; P$3 3.6,-4.4 | smd 2.8 x 2.8: P$2 -3.6,-12; P$4 0.7,-15.7 | hole 1.7: 0,-3.5; 0,-10.5
ESP12-SMD = smd 3 x 1.2: ADC -8.3,3.8; CH_PD -8.3,1.8; GND 8.1,-8.2; GPIO0 8.1,-2.2; GPIO2 8.1,-4.2; GPIO4 8.1,-0.2; GPIO5 8.1,1.8; GPIO12 -8.3,-4.2; GPIO13 -8.3,-6.2; GPIO14 -8.3,-2.2; GPIO15 8.1,-6.2; GPIO16 -8.3,-0.2; RESET -8.3,5.8; RXD0 8.1,3.8; TXD0 8.1,5.8; VCC -8.3,-8.2
FE05-1 = drill 0.813 long: 1 -5.08,0; 2 -2.54,0; 3 0,0; 4 2.54,0; 5 5.08,0
CTS406 = smd 1.9 x 1.4: 1 -2.2,-1.2; 2 2.2,-1.2; 3 2.2,1.2; 4 -2.2,1.2
RJ45-8 = drill 1 pad 1.88 square: 1 -4.445,6.35 | drill 1 pad 1.88: 2 -3.175,8.89; 3 -1.905,6.35; 4 -0.635,8.89; 5 0.635,6.35; 6 1.905,8.89; 7 3.175,6.35; 8 4.445,8.89 | hole 3.2: -5.715,0; 5.715,0
CHIP-LED0805 = smd 1.2 x 1.2: A 0,-1.05; C 0,1.05
SOT-223 = smd 1 x 2.1: 1 -2.3,-3.1; 2 0,-3.1; 3 2.3,-3.1 | smd 3.7 x 2.1: 4 0,3.1
FE12-2 = drill 0.914: 1 -13.97,1.27 | drill 0.914 octagon: 2 -13.97,-1.27; 3 -11.43,1.27; 4 -11.43,-1.27; 5 -8.89,1.27; 6 -8.89,-1.27; 7 -6.35,1.27; 8 -6.35,-1.27; 9 -3.81,1.27; 10 -3.81,-1.27; 11 -1.27,1.27; 12 -1.27,-1.27; 13 1.27,1.27; 14 1.27,-1.27; 15 3.81,1.27; 16 3.81,-1.27; 17 6.35,1.27; 18 6.35,-1.27; 19 8.89,1.27; 20 8.89,-1.27; 21 11.43,1.27; 22 11.43,-1.27; 23 13.97,1.27; 24 13.97,-1.27
RPI3 = drill 1.016 square: P$1 8.37,51.23 | drill 1.016: P$2 8.357,53.772; P$3 10.897,51.232; P$4 10.897,53.772; P$5 13.437,51.232; P$6 13.437,53.772; P$7 15.977,51.232; P$8 15.977,53.772; P$9 18.517,51.232; P$10 18.517,53.772; P$11 21.057,51.232; P$12 21.057,53.772; P$13 23.597,51.232; P$14 23.597,53.772; P$15 26.137,51.232; P$16 26.137,53.772; P$17 28.677,51.232; P$18 28.677,53.772; P$19 31.217,51.232; P$20 31.217,53.772; P$21 33.757,51.232; P$22 33.757,53.772; P$23 36.297,51.232; P$24 36.297,53.772; P$25 38.837,51.232; P$26 38.837,53.772; P$27 41.377,51.232; P$28 41.377,53.772; P$29 43.917,51.232; P$30 43.917,53.772; P$31 46.457,51.232; P$32 46.457,53.772; P$33 48.997,51.232; P$34 48.997,53.772; P$35 51.537,51.232; P$36 51.537,53.772; P$37 54.077,51.232; P$38 54.077,53.772; P$39 56.617,51.232; P$40 56.617,53.772 | hole 2.75: 61.5,3.5
R0603 = smd 1 x 1.1: 1 -0.85,0; 2 0.85,0
RFM12 = smd 1.5 x 3: 1 -5,-10; 2 -3,-10; 3 -1,-10; 4 1,-10; 5 3,-10; 6 5,-10; 7 7,-10; 8 7,6; 9 5,6; 10 3,6; 11 1,6; 12 -1,6; 13 -3,6; 14 -5,6
B3F-31XX = drill 1.016 octagon: 1 -2.261,-1.245; 2 2.261,-1.245 | drill 1.499 pad 2.159: 3 -3.505,1.245; 4 3.505,1.245
SJ_2S-NO = smd 0.635 x 1.27: 1 -0.45,0; 2 0.45,0
1X03 = drill 1.016 pad 1.88: 1 0,0; 2 2.54,0; 3 5.08,0
TQFP100 = smd 0.27 x 1.5: 1 -6,-7.75; 2 -5.5,-7.75; 3 -5,-7.75; 4 -4.5,-7.75; 5 -4,-7.75; 6 -3.5,-7.75; 7 -3,-7.75; 8 -2.5,-7.75; 9 -2,-7.75; 10 -1.5,-7.75; 11 -1,-7.75; 12 -0.5,-7.75; 13 0,-7.75; 14 0.5,-7.75; 15 1,-7.75; 16 1.5,-7.75; 17 2,-7.75; 18 2.5,-7.75; 19 3,-7.75; 20 3.5,-7.75; 21 4,-7.75; 22 4.5,-7.75; 23 5,-7.75; 24 5.5,-7.75; 25 6,-7.75; 51 6,7.75; 52 5.5,7.75; 53 5,7.75; 54 4.5,7.75; 55 4,7.75; 56 3.5,7.75; 57 3,7.75; 58 2.5,7.75; 59 2,7.75; 60 1.5,7.75; 61 1,7.75; 62 0.5,7.75; 63 0,7.75; 64 -0.5,7.75; 65 -1,7.75; 66 -1.5,7.75; 67 -2,7.75; 68 -2.5,7.75; 69 -3,7.75; 70 -3.5,7.75; 71 -4,7.75; 72 -4.5,7.75; 73 -5,7.75; 74 -5.5,7.75; 75 -6,7.75 | smd 1.5 x 0.27: 26 7.75,-6; 27 7.75,-5.5; 28 7.75,-5; 29 7.75,-4.5; 30 7.75,-4; 31 7.75,-3.5; 32 7.75,-3; 33 7.75,-2.5; 34 7.75,-2; 35 7.75,-1.5; 36 7.75,-1; 37 7.75,-0.5; 38 7.75,0; 39 7.75,0.5; 40 7.75,1; 41 7.75,1.5; 42 7.75,2; 43 7.75,2.5; 44 7.75,3; 45 7.75,3.5; 46 7.75,4; 47 7.75,4.5; 48 7.75,5; 49 7.75,5.5; 50 7.75,6; 76 -7.75,6; 77 -7.75,5.5; 78 -7.75,5; 79 -7.75,4.5; 80 -7.75,4; 81 -7.75,3.5; 82 -7.75,3; 83 -7.75,2.5; 84 -7.75,2; 85 -7.75,1.5; 86 -7.75,1; 87 -7.75,0.5; 88 -7.75,0; 89 -7.75,-0.5; 90 -7.75,-1; 91 -7.75,-1.5; 92 -7.75,-2; 93 -7.75,-2.5; 94 -7.75,-3; 95 -7.75,-3.5; 96 -7.75,-4; 97 -7.75,-4.5; 98 -7.75,-5; 99 -7.75,-5.5; 100 -7.75,-6
47589-0001 = smd 1.35 x 0.4: 1 2.8,1.3; 2 2.8,0.65; 3 2.8,0; 4 2.8,-0.65; 5 2.8,-1.3 | drill 0.6 pad 0.95 long: CASING1 0,4.175; CASING2 0,-4.175 | drill 0.7 pad 1.1 long: CASING3 3,2.225; CASING4 3,-2.225
OMNIMATE_LSF_3 = drill 1.1 pad 1.9: P$1 -3.5,-3.5; P$2 -3.5,3.5; P$3 0,-3.5; P$4 0,3.5; P$5 3.5,-3.5; P$6 3.5,3.5
OMNIMATE_LSF_2 = drill 1.1 pad 1.9: P$1 -3.5,-3.5; P$2 -3.5,3.5; P$3 0,-3.5; P$4 0,3.5
DCJACK_2MM_SMT = smd 2.4 x 2: GND 0,-5.5; GNDBREAK 6.2,-5.5; PWR1 0,5.5; PWR2 6.2,5.5 | hole 1.6: 0,0 | hole 1.8: 4.5,0
CRYSTAL_8X3.8 = smd 1.3 x 1.9: P$1 -2.75,-1.6; P$2 2.75,-1.6; P$3 2.75,1.6; P$4 -2.75,1.6

### Placement (x,y rotation side)
BOOT0  40.83,50.2 180 top
C3  113.22,15.91 90 top
C4  107.99,30.95 270 top
C5  60.32,39.16 0 top
C6  66.77,55.67 90 top
C8  50.55,59.71 180 top
C9  46.4,43.52 270 top
C10  63.35,35.1 180 top
C14  55.64,27.84 270 top
C15  58.07,27.84 270 top
C16  58.78,61.01 0 top
C18  68.44,44.45 180 top
C22  103.01,30.51 270 top
CF1  18.25,76.36 180 top
CF2  29.47,76.53 180 top
CF3  41.84,76.41 180 top
CF4  54.8,76.1 180 top
CF5  67.3,76.16 180 top
CF6  80.19,76.39 180 top
CF7  87.51,76.23 0 top
CF8  105.47,75.75 180 top
CF9  111.81,78.71 270 top
CFV1  21.96,71.5 90 top
CFV2  21.87,61.76 90 top
CFV3  21.87,48.01 90 top
CT1  13.97,98.69 0 top
CT2  26.67,98.69 0 top
CT3  39.37,98.69 0 top
CT4  52.07,98.69 0 top
CT5  64.77,98.69 0 top
CT6  77.47,98.69 0 top
CT7  90.17,98.69 0 top
CT8  102.87,98.69 0 top
CT9  115.57,98.69 0 top
ESP12  114.25,62.93 90 bottom
GND  54.24,66.63 0 top
HSE  56.83,33.61 270 top
J1  9.45,23.9 270 top
LED1  82.27,51.94 270 top
LED2  82.36,47.84 270 top
LED3  82.3,43.78 270 top
LOGO1  OSHW_LOGO_6MILX0200-NT  [OSHW_6X200_NOTEXT]  27.89,49.42 0 bottom
MCP1825  104.57,21.98 90 top
MODULE_HEADER  77.47,66.04 0 top
PCB1  43.56,84.99 270 top
R1  70.32,52.26 270 top
R2  44.78,46.23 180 top
R3  62.35,61.1 180 top
R4  72.77,59.44 180 top
R5  72.77,57.02 0 top
R22  68.26,47.13 90 top
R23  72.35,46.24 180 top
RB1  14.69,79.88 0 top
RB2  27.37,79.76 0 top
RB3  40,79.92 0 top
RB4  52.69,79.79 0 top
RB5  65.43,79.74 0 top
RB6  78.16,80.09 0 top
RB7  90.88,79.93 0 top
RB8  103.53,79.86 0 top
RB9  116.35,80.04 0 top
RF1  15.45,77.14 270 top
RF2  26.57,77.11 270 top
RF3  39.15,77.33 270 top
RF4  51.85,76.96 270 top
RF5  64.62,77.06 270 top
RF6  77.31,77.42 270 top
RF7  90.06,77.19 270 top
RF8  102.65,76.6 270 top
RF9  114.76,77.87 180 top
RFM69HCW  111.59,38.43 180 bottom
RFV1  19.31,72.37 0 top
RFV2  19.14,62.65 0 top
RFV3  19.14,48.78 0 top
RVPU1  16.07,72.35 180 top
RVPU2  15.85,62.68 180 top
RVPU3  15.92,48.8 0 top
RVPU11  17.69,68.14 270 top
RVPU22  17.42,58.16 270 top
RVPU33  17.68,44.32 270 top
S1  124.74,10.69 90 top
SJ1  51.84,62.97 270 top
STLINK  39.26,63.17 180 top
STM32F303VB  56.51,49.26 0 top
U$1  127.15,20.78 180 top
U$4  12.63,5.7 0 top
U$5  24.31,5.68 0 top
U$6  36,5.67 0 top
U$11  109.12,6.34 0 top
VT1  4.13,71.12 0 top
VT2  4.13,57.15 0 top
VT3  4.13,43.18 0 top
Y1  51.53,33.77 270 top

### Tracks (layer width: path | path; a pad name or v marks a point on that pad's centre or on a via)
+3V3  (via drill 0.5)
  Top 0.254: SJ1.2 51.27,62.52 49.7,60.95 C8.2 47.98,59.33 44.91,59.33 39.83,64.41 38.61,64.41 38,63.8 38,62.59 43.48,57.1 50.39,57.1 STM32F303VB.75 50.39,56.9 50.39,54.63 | C6.2 66.72,55.68 64.82,55.68 64.41,55.27 STM32F303VB.50 61.4,55.26 61.27,54.63 50.39,54.63 | 50.39,54.63 50.39,44.09 49.58,43.28 48.77,43.28 STM32F303VB.100 48.56,43.28 47.95,42.67 46.53,42.67 C9.2 46.33,42.67 45.92,42.67 38.41,50.19 BOOT0.2 | MCP1825.3 108.92,26.78 108.92,28.5 C4.2 | C4.2 103.44,29.55 C22.2 | 60.96,41.45 60.96,40.64 61.16,40.44 61.16,39.22 C5.2 | 60.96,41.45 60.55,41.45 STM32F303VB.21 | 60.96,41.45 STM32F303VB.22 60.96,41.66 60.96,43.08 | 60.96,43.08 62.18,44.3 64.21,44.3 STM32F303VB.28 | v70.48,49.53 70.48,51.63 R1.2 70.32,51.29 68.53,49.51 68.53,48.26 R22.2 67.94,47.62 66.67,46.35 v66.67,36.2 | v106.05,29.84 107.95,29.84 C4.2 | U$5.P$2 20.95,8.89 20.95,2.54 U$5.P$1 | v59.69,44.45 60.96,43.18 60.96,43.08
  Bottom 0.254: 10.36,3.45 16.66,3.45 17.88,2.23 20.73,2.23 U$5.P$1 | 10.36,3.45 9.14,2.23 U$4.P$1 | 10.36,3.45 10.36,7.96 U$4.P$2 | v70.48,49.53 76.2,55.24 105.41,55.24 | 105.41,55.24 106.05,55.24 ESP12.VCC | 106.05,30.48 105.41,30.48 105.41,55.24 | 106.05,30.48 116.2,30.48 116.2,32.38 RFM69HCW.9 | 106.05,30.48 v106.05,29.84 | v59.69,44.45 55.24,48.9 40.01,48.9 38.73,50.16 BOOT0.2 38.1,50.16 37.47,50.16 29.21,41.91 29.21,40.01 29.84,40.01 | 29.84,40.01 29.84,8.89 28.57,7.62 22.23,7.62 20.95,8.89 U$5.P$2 | v66.67,36.2 62.87,40.01 29.84,40.01
+5V  (via drill 0.5)
  Top 0.406: v104.39,25.25 104.39,20.8 105.52,19.68 MCP1825.1 107.67,19.59 109.35,17.91 109.95,17.31 C3.2 115.39,19.48 U$1.1
  Bottom 0.406: v104.39,25.25 103.59,26.04 85.31,26.04 56.9,54.46 56.9,62.45 GND.3
AC1
  Top 0.254: RVPU1.2 15.04,72.54 14.43,72.54 10.36,76.61 VT1.PWR2
AC2
  Top 0.254: RVPU2.2 14.83,62.79 10.36,62.79 VT2.PWR2
AC3
  Top 0.254: RVPU3.1 15.04,48.77 10.36,48.77 VT3.PWR2
ADC0
  Top 0.254: 17.68,48.77 18.29,48.77 RFV3.1 | 17.68,48.77 16.87,48.77 RVPU3.2 | 17.68,48.77 17.68,45.31 RVPU33.1
BIAS
  Top 0.254: CT8.P$4 103.63,82.91 104.24,82.3 104.24,80.06 RB8.2 104.24,79.86 104.24,77.42 | CT7.P$4 91.03,82.91 91.64,82.3 91.64,80.06 RB7.2 91.64,79.86 91.64,78.03 | CT6.P$4 78.23,82.91 78.84,82.3 78.84,80.26 RB6.2 78.84,80.06 78.84,78.23 | 78.84,78.23 78.03,77.42 76.61,77.42 76.4,77.22 76.4,71.12 73.56,68.28 73.26,68.28 72.69,67.71 72.69,67.41 71.02,65.73 70.4,65.73 69.94,65.28 69.94,63.52 69.23,62.81 69.23,51.01 65.97,47.75 64.41,47.75 STM32F303VB.35 | 91.64,78.03 90.83,77.22 79.86,77.22 78.84,78.23 | 104.24,77.42 103.43,76.61 98.96,76.61 97.54,78.03 91.64,78.03 | 15.85,43.28 17.48,43.28 RVPU33.2 | 15.85,43.28 10.36,37.8 VT3.GNDBREAK 10.16,37.59 9.75,37.19 5.28,37.19 4.88,37.59 4.27,37.59 VT3.GND | 7.32,52.22 9.75,52.22 10.16,51.82 VT2.GNDBREAK 10.36,51.61 13.82,51.61 15.85,49.58 15.85,43.28 | 7.32,52.22 5.49,52.22 5.08,51.82 4.27,51.82 VT2.GND | 7.32,65.23 9.96,65.23 10.16,65.43 VT1.GNDBREAK 10.36,65.63 11.99,67.26 17.68,67.26 RVPU11.2 17.88,67.46 19.3,68.89 19.3,74.98 20.12,75.79 20.12,77.72 17.98,79.86 15.65,79.86 RB1.2 15.44,80.06 15.44,82.3 14.83,82.91 CT1.P$4 14.83,83.11 14.83,87.17 15.24,87.58 15.24,96.52 | 7.32,65.23 5.28,65.23 5.08,65.43 4.27,65.43 VT1.GND | 7.32,65.23 7.32,52.22 | RVPU22.2 17.48,57.51 19.1,59.13 19.1,65.43 29.46,75.79 29.46,78.44 28.25,79.65 RB2.2 28.04,79.86 27.43,80.47 27.43,82.91 CT2.P$4 27.43,83.11 27.43,87.17 28.04,87.78 28.04,96.52 | RB5.2 66.24,79.86 66.24,82.3 65.63,82.91 CT5.P$4 65.63,83.11 65.63,87.17 66.04,87.58 66.04,96.52 | 66.04,96.52 73.56,96.52 73.76,96.32 CT6.P$1 73.97,96.32 74.17,96.52 77.83,96.52 78.03,96.32 86.56,96.32 CT7.P$1 86.77,96.32 89.61,96.32 89.81,96.52 98.96,96.52 99.16,96.32 CT8.P$1 99.36,96.32 99.57,96.52 103.23,96.52 103.43,96.32 111.96,96.32 CT9.P$1 112.17,96.11 112.17,89.81 116.23,85.75 116.23,83.11 CT9.P$4 116.43,82.91 117.04,82.3 117.04,80.06 RB9.2 117.04,79.86 117.04,77.83 116.23,77.01 111.15,77.01 110.74,77.42 104.24,77.42
  Top 0.254: 66.04,96.52 64.41,96.52 64.21,96.32 61.37,96.32 CT5.P$1 61.16,96.32 52.63,96.32 52.43,96.52 48.77,96.52 48.56,96.32 CT4.P$1 | 15.24,96.52 22.76,96.52 22.96,96.32 CT2.P$1 23.16,96.32 26.01,96.32 26.21,96.52 28.04,96.52 | 15.24,96.52 13.61,96.52 13.41,96.32 10.57,96.32 CT1.P$1 | RB4.2 53.44,79.86 53.44,82.3 52.83,82.91 CT4.P$4 52.63,83.11 52.63,85.75 48.56,89.81 48.56,96.11 CT4.P$1 | RB3.2 40.84,80.06 40.84,82.3 40.23,82.91 CT3.P$4 40.23,83.11 40.23,87.17 40.64,87.58 40.64,96.52 | 40.64,96.52 48.16,96.52 48.36,96.32 CT4.P$1 | 40.64,96.52 39.01,96.52 38.81,96.32 35.97,96.32 CT3.P$1 35.76,96.32 35.56,96.52 28.04,96.52
BIAS_IN  (via drill 0.5)
  Top 0.254: C18.2 67.67,44.5 67.67,45.72 68.07,46.13 R22.1 68.28,46.33 68.47,46.33 | 68.47,46.33 71.32,46.33 R23.2 | STM32F303VB.36 65.5,48.26 66.45,49.22 v66.45,49.4 | v69.03,45.77 68.47,46.33
  Bottom 0.254: v66.45,49.4 66.45,48.34 v69.03,45.77
BOOT0
  Top 0.254: STM32F303VB.94 48.56,46.33 45.72,46.33 R2.1 45.52,46.33 41.66,50.19 40.84,50.19 BOOT0.1
CT1  (via drill 0.5)
  Top 0.254: RF1.2 15.65,76.4 17.27,76.4 CF1.2 17.48,76.2 v18.49,75.18 | v64.82,42.47 65.43,43.08 65.43,44.5 65.23,44.7 64.41,44.7 STM32F303VB.29 | v33.73,59.94 v40.44,53.24
  Bottom 0.254: v64.82,42.47 63.8,42.47 53.03,53.24 v40.44,53.24 | v18.49,75.18 v33.73,59.94
CT2
  Top 0.254: CF2.2 28.45,76.4 26.62,76.4 RF2.2 26.42,76.2 26.42,73.56 22.55,69.7 22.15,69.7 15.85,63.4 15.85,57.3 47.14,26.01 58.73,26.01 59.54,26.82 59.54,33.73 65.84,40.03 65.84,44.7 65.23,45.31 64.41,45.31 STM32F303VB.30
CT3
  Top 0.254: CF3.2 40.84,76.61 39.22,76.61 RF3.2 39.01,76.4 32.92,70.31 32.92,53.65 44.91,41.66 48.56,41.66 52.63,45.72 64.21,45.72 STM32F303VB.31
CT4  (via drill 0.5)
  Top 0.254: RF4.2 52.02,76.2 53.85,76.2 CF4.2 54.05,76 v57.71,72.34 | v65.89,46.8 65.42,46.33 64.41,46.33 STM32F303VB.32
  Bottom 0.254: v65.89,46.8 65.89,48.44 57.84,56.49 57.84,72.21 v57.71,72.34
CT5  (via drill 0.5)
  Top 0.254: CF5.2 66.45,76.2 RF5.2 64.41,76.2 64.41,70.27 61.98,67.84 61.99,66.32 v61.8,66.13 | v61.98,54.46 61.12,53.6 61.12,48.31 62.69,46.74 64.21,46.74 STM32F303VB.33
  Bottom 0.254: v61.8,66.13 61.8,65.54 62.47,64.87 62.47,54.95 v61.98,54.46
CT6  (via drill 0.5)
  Top 0.254: 78.18,76.4 79.25,76.4 CF6.2 | 78.18,76.4 77.42,76.4 RF6.2 | STM32F303VB.34 63.12,47.26 61.98,48.4 61.98,53.18 62.67,53.87 v62.78,53.87 | v78.14,75.04 78.18,75.09 78.18,76.4
  Bottom 0.254: v62.78,53.87 71.13,62.22 71.13,63.41 72.08,64.37 72.08,65.07 73.36,66.34 74.06,66.34 74.62,66.91 74.62,67.61 78.14,71.12 v78.14,75.04
CT7  (via drill 0.5)
  Top 0.254: RF7.2 90.02,76.4 88.39,76.4 CF7.2 88.19,76.2 87.38,75.39 v85.34,75.39 | v62.79,52.83 64.21,52.83 STM32F303VB.45
  Bottom 0.254: v85.34,75.39 77.17,67.21 77.17,66.91 76.6,66.34 76.3,66.34 74.62,64.67 74.62,64.37 74.06,63.8 73.76,63.8 v62.79,52.83
CT8  (via drill 0.5)
  Top 0.254: CF8.2 104.44,75.79 102.82,75.79 RF8.2 102.62,75.59 102.41,75.39 94.49,75.39 87.33,68.22 87.33,66.91 86.76,66.34 85.45,66.34 84.78,65.68 84.78,57.51 80.31,53.03 v72.14,53.03 | v66.54,52.13 65.43,53.24 64.41,53.24 STM32F303VB.46
  Bottom 0.254: v72.14,53.03 71.23,52.13 v66.54,52.13
CT9  (via drill 0.5)
  Top 0.254: RF9.2 113.79,77.83 111.96,77.83 CF9.2 111.76,78.03 105.05,84.73 104.44,84.73 99.57,89.61 73.56,89.61 72.14,88.19 72.14,71.98 68.43,68.28 68.18,68.28 67.61,67.71 67.61,67.46 65.89,65.73 65.64,65.73 65.08,65.17 65.08,64.92 62.38,62.23 62.38,60.35 63.19,59.54 v63.82,59.54 | STM32F303VB.51 63.13,57.63 v63.52,57.63
  Bottom 0.254: v63.52,57.63 63.52,59.24 v63.82,59.54
DS18B20  (via drill 0.5)
  Top 0.254: 15.86,5.09 12.8,2.03 U$4.P$3 | 15.86,5.09 19.51,8.74 19.51,9.75 30.99,21.23 60.94,21.23 72.34,32.64 72.34,49.56 71.34,50.56 71.34,52.08 R1.1 70.28,53.15 v70.28,54.39 | v66.53,53.42 66.19,53.76 STM32F303VB.47 | 15.86,5.09 15.86,5.96 U$4.P$4
  Bottom 0.254: v70.28,54.39 69.12,53.23 68.39,53.23 68.21,53.42 v66.53,53.42
GND  (via drill 0.5)
  Top 0.254: CF9.1 111.76,79.38 111.86,79.51
  other vias: 52.51,60.5 60.71,55.5 67.51,54.25 57.8,39.28 61.1,32.51 45.38,36.42 43.07,47.14 45.08,44.89 21,70.07 23.49,68.48 25.96,70.19 17.72,77.74 71.03,43.14 35.28,55.66 46.26,50.95 52.97,50.81 56.83,51.24 59.51,53.42 47.59,56.17 48.19,38.94 52.27,39.14 52.59,33.55 70.6,48.51 12.85,54.51 14.51,59.6 15.13,65.59 83.23,82.34 96.24,82.4 107.02,80.98 101.91,85.61 114.95,85.49 51.13,85.53 28.28,78.08 66.96,62.53 49.42,57.9 63.87,56.42 111.13,81.29 80.69,73.45 82.64,71.27 70.35,73.17 74.14,72.78
  pour Top (isolate 0.152): 141.76,-7.37 -8.73,-7.37 -8.73,106.82 141.76,106.82
  pour Bottom: -18.46,104.28 -18.46,-6.1 140.11,-6.1 140.11,104.28
HSE_IN  (via drill 0.5)
  Top 0.254: 54.46,34.75 54.46,30.48 55.47,29.46 55.47,28.85 C14.1 | 54.46,34.75 55.47,35.76 HSE.1 | v51.41,43.48 54.86,43.48 56.08,42.27 56.08,41.66 STM32F303VB.12 | v43.08,42.47 43.08,41.25 49.58,34.75 54.46,34.75
  Bottom 0.254: v51.41,43.48 44.09,43.48 v43.08,42.47
HSE_OUT
  Top 0.254: C15.1 58.12,28.85 58.12,31.29 HSE.3 57.91,31.5 56.9,32.51 56.9,36.78 56.49,37.19 56.49,41.45 STM32F303VB.13
LED1  (via drill 0.5)
  Top 0.254: R3.2 61.32,60.91 v61.32,60.27 | STM32F303VB.55 60.51,58.34 v59.94,58.91
  Bottom 0.254: v61.32,60.27 61.3,60.27 v59.94,58.91
LED2  (via drill 0.5)
  Top 0.254: R4.2 v70.18,57.69 v70.17,57.69 | v68.27,57.02 67.72,57.02 66.18,58.55 63.42,58.55 63.41,58.55 v61.81,58.55 | v59.81,55.72 60.01,55.92 STM32F303VB.56
  Bottom 0.254: v70.17,57.69 69.49,57.02 v68.27,57.02 | v61.81,58.55 59.81,56.55 v59.81,55.72
LED3  (via drill 0.5)
  Top 0.254: STM32F303VB.57 59.51,57.93 58.63,58.8 v58.63,59.27 | v64.71,66.1 64.71,65.99 64.61,65.89 62.82,65.89 62.37,65.44 62.37,63.65 v61.17,62.45 | v70.15,62.45 72.33,60.27 72.54,60.27 72.84,59.96 72.84,58.77 73.62,57.99 R5.2
  Bottom 0.254: v58.63,59.27 61.17,61.8 v61.17,62.45 | v70.15,62.45 68.36,62.45 67,63.8 67,65.17 66.44,65.73 65.08,65.73 v64.71,66.1
N$1
  Top 0.254: GND.2 51.7,63.56 SJ1.1
N$2
  Top 0.254: RF1.1 15.44,78.03 15.44,78.44 14.02,79.86 RB1.1 13.82,80.06 13.82,80.47 10.57,83.72 10.57,86.56 CT1.P$2
N$5  (via drill 0.5)
  Top 0.254: v75.72,53.82 75.72,57.31 73.66,59.37 R4.1 | v80.33,49.21 81.12,48.42 81.12,47.98 LED2.A
  Bottom 0.254: v80.33,49.21 v75.72,53.82
N$6
  Top 0.254: R5.1 71.91,56.99 71.44,56.52 71.44,52.7 80.33,43.81 81.12,43.81 LED3.A
N$8
  Top 0.254: RF2.1 26.62,78.03 26.62,79.65 RB2.1 26.42,79.86 26.42,80.67 23.16,83.92 23.16,86.56 CT2.P$2
N$9
  Bottom 0.254: RFM69HCW.10 114.94,33.02 114.94,46.35 117.47,46.35 118.11,46.99 118.11,48.26 RFM69HCW.7
N$10
  Top 0.254: RF3.1 39.22,78.23 39.22,79.86 RB3.1 39.01,80.06 39.01,80.67 35.97,83.72 35.97,86.56 CT3.P$2
N$34
  Top 0.254: 17.48,62.79 18.09,62.79 RFV2.1 | 17.48,62.79 16.87,62.79 RVPU2.1 | 17.48,62.79 17.48,59.13 RVPU22.1
N$37
  Top 0.254: 17.68,72.34 18.29,72.34 RFV1.1 | 17.68,72.34 17.07,72.34 RVPU1.1 | 17.68,72.34 17.68,69.09 RVPU11.1
N$38
  Top 0.254: RF4.1 51.82,77.83 51.82,79.65 RB4.1 51.82,79.86 51.82,80.67 48.56,83.92 48.56,86.56 CT4.P$2
N$39
  Top 0.254: RF5.1 64.62,78.03 64.62,79.65 RB5.1 64.41,79.86 64.41,80.67 61.37,83.72 61.37,86.56 CT5.P$2
N$40
  Top 0.254: RF6.1 77.42,78.44 77.42,80.06 RB6.1 77.22,80.26 77.22,80.67 73.97,83.92 73.97,86.56 CT6.P$2
N$41  (via drill 0.5)
  Top 0.254: v67.47,66.36 67.47,64.77 66.2,63.5 66.2,61.12 63.34,61.12 R3.1 | v87.47,58.26 81.28,52.07 LED1.A
  Bottom 0.254: v67.47,66.36 67.47,76.2 85.57,76.2 87.47,74.3 v87.47,58.26
N$42
  Top 0.254: RF7.1 90.02,78.23 90.02,79.86 RB7.1 90.02,80.06 90.02,80.47 86.77,83.72 86.77,86.56 CT7.P$2
N$43
  Top 0.254: RF8.1 102.62,77.62 102.62,79.86 RB8.1 102.62,80.06 102.62,80.67 99.36,83.92 99.36,86.56 CT8.P$2
N$44
  Top 0.254: RF9.1 115.62,78.03 115.62,79.86 RB9.1 115.42,80.06 115.42,80.47 112.17,83.72 112.17,86.56 CT9.P$2
NRST  (via drill 0.5)
  Top 0.254: v65.63,38.2 62.59,35.15 C10.2 62.41,35.1 v61.7,34.38 | STM32F303VB.14 57.01,38.62 58.13,37.5 v58.19,37.5 | v75.18,34.33 75.22,34.38 v79.08,34.38
  Bottom 0.254: STLINK.3 34.34,62.99 35.56,61.77 53.85,61.77 56.05,59.58 56.05,53.62 65.63,44.03 v65.63,38.2 69.5,34.33 v75.18,34.33 | S1.1 125.98,8.53 124.16,8.53 97.94,34.75 93.52,34.75 93.14,34.38 v79.08,34.38 | v58.19,37.5 58.58,37.5 v61.7,34.38
PC14
  Top 0.254: STM32F303VB.8 54.05,41.66 54.05,42.27 53.65,42.67 50.39,42.67 49.99,42.27 49.99,36.58 Y1.P$1
PC15
  Top 0.254: STM32F303VB.9 54.46,41.45 54.46,37.8 53.24,36.58 Y1.P$4
PULSE  (via drill 0.5)
  Top 0.254: 59.54,60.22 59.54,60.21 59.8,60.21 61.01,59 STM32F303VB.54 | 59.54,60.22 59.54,60.87 C16.2 | STM32F303VB.54 | v55.23,59.09 56.37,60.22 59.54,60.22 | U$5.P$3 24.38,2.23 24.38,9.14 U$5.P$4
  Bottom 0.254: v55.23,59.09 45.27,59.09 24.38,38.2 24.38,9.35 U$5.P$4
SWCLK
  Top 0.254: STM32F303VB.76 48.56,55.27 44.5,55.27 36.78,62.99 STLINK.2
SWDIO
  Top 0.254: STM32F303VB.72 52.02,57.1 52.02,58.58 51.87,58.73 43.68,58.73 39.42,62.99 STLINK.1
UART_RX
  Top 0.254: STM32F303VB.69 53.44,57.1 53.44,62.79 56.84,66.19 57.2,66.19 GND.4
UART_TX
  Top 0.254: STM32F303VB.68 54.05,57.1 54.05,61.29 55.78,63.02 55.85,63.16 GND.5
VSIG1  (via drill 0.5)
  Top 0.254: CFV1.2 21.95,72.34 20.32,72.34 RFV1.2 20.12,72.34 20.12,68.28 16.05,64.21 9.14,64.21 8.74,63.8 8.74,61.57 8.94,61.37 10.97,61.37 22.76,49.58 22.76,49.38 v30.48,41.66 | v61.77,42.88 61.57,42.67 61.57,41.66 STM32F303VB.23
  Bottom 0.254: v61.77,42.88 51.82,42.88 50.6,41.66 v30.48,41.66
VSIG2
  Top 0.254: RFV2.2 20.12,62.59 21.74,62.59 CFV2.2 21.95,62.59 22.76,61.77 22.76,60.96 51.21,32.51 51.21,30.89 54.25,27.84 58.73,27.84 59.13,28.25 59.13,33.93 62.18,36.98 62.18,39.62 61.98,39.83 61.98,41.45 STM32F303VB.24
VSIG3  (via drill 0.5)
  Top 0.254: RFV3.2 20.12,48.77 21.74,48.77 CFV3.2 21.95,48.77 v29.87,40.84 | v63.2,41.45 62.59,41.45 STM32F303VB.25
  Bottom 0.254: v63.2,41.45 51,41.45 50.39,40.84 v29.87,40.84

### Text on the board
bPlace: Designed in | North Wales | Made in UK
tNames: VT1 | UART | VT2 | VT3
tValues: DIO | CLK | RST | emonSTM32 | v0.1 | Development Board | OpenEnergyMonitor | TX | RX | 5V | 3.3 | GND | T | 3V3 | GND | P | 3V3 | Open-Hardware | DS18B20 | PULSE INPUT
tDocu: 128.92 x / 99.45 y